# Altium project Cells_in_Space.PrjPcb (part 1 of 2)
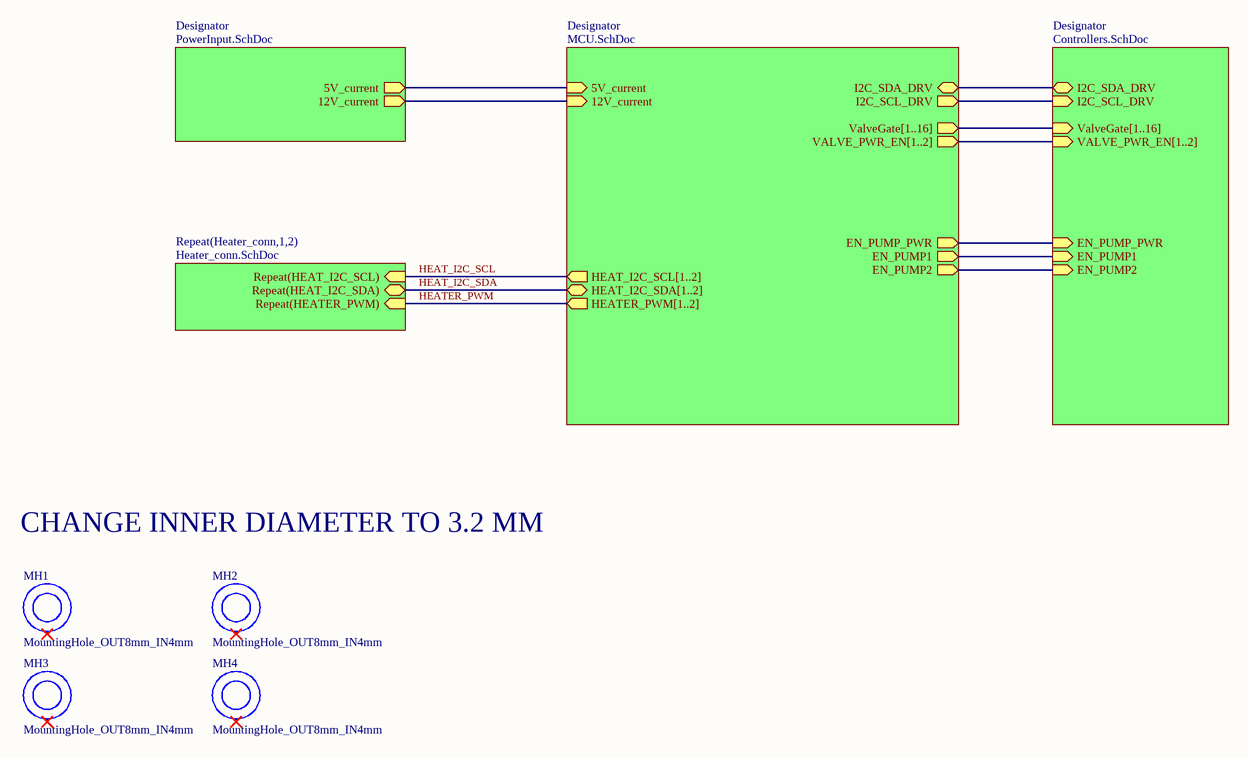
[diagram p0: GraviTE_TOP.SchDoc]
7 sheets, 230 parts. Net scope: hierarchical (ports join the sheet entries above them; power ports are global).
Board file: ISS_PCB.PcbDoc
Sheets:
  GraviTE_TOP.SchDoc
    Designator = PowerInput.SchDoc
    Designator = MCU.SchDoc
    Designator = Controllers.SchDoc
      CC_oct_driver1 = CC_oct_driver.SchDoc
      CC_oct_driver2 = CC_oct_driver.SchDoc
      Valve1 = Valve.SchDoc
      Valve2 = Valve.SchDoc
      Valve3 = Valve.SchDoc
      Valve4 = Valve.SchDoc
      Valve5 = Valve.SchDoc
      Valve6 = Valve.SchDoc
      Valve7 = Valve.SchDoc
      Valve8 = Valve.SchDoc
      Valve9 = Valve.SchDoc
      Valve10 = Valve.SchDoc
      Valve11 = Valve.SchDoc
      Valve12 = Valve.SchDoc
      Valve13 = Valve.SchDoc
      Valve14 = Valve.SchDoc
      Valve15 = Valve.SchDoc
      Valve16 = Valve.SchDoc
    Heater_conn1 = Heater_conn.SchDoc
    Heater_conn2 = Heater_conn.SchDoc

## Sheet GraviTE_TOP.SchDoc
size A4; SheetNumber: 1; SheetTotal: 7

### Parts
MH1  MountingHole_OUT8mm_IN4mm  [MountingHole_OUT8mm_IN4mm]
MH2  MountingHole_OUT8mm_IN4mm  [MountingHole_OUT8mm_IN4mm]
MH3  MountingHole_OUT8mm_IN4mm  [MountingHole_OUT8mm_IN4mm]
MH4  MountingHole_OUT8mm_IN4mm  [MountingHole_OUT8mm_IN4mm]

### Sub-sheets
Designator = PowerInput.SchDoc: 5V_current (out), 12V_current (out)
Designator = MCU.SchDoc: EN_PUMP_PWR (out), EN_PUMP1 (out), EN_PUMP2 (out), 12V_current (in), 5V_current (in), HEAT_I2C_SCL[1..2] (out), HEAT_I2C_SDA[1..2] (bidir), HEATER_PWM[1..2] (out), ValveGate[1..16] (out), VALVE_PWR_EN[1..2] (out), I2C_SDA_DRV (bidir), I2C_SCL_DRV (out)
Designator = Controllers.SchDoc: EN_PUMP_PWR (in), EN_PUMP1 (in), EN_PUMP2 (in), ValveGate[1..16] (in), VALVE_PWR_EN[1..2] (in), I2C_SDA_DRV (bidir), I2C_SCL_DRV (in)
Repeat(Heater_conn,1,2) = Heater_conn.SchDoc: Repeat(HEAT_I2C_SCL) (in), Repeat(HEAT_I2C_SDA) (bidir), Repeat(HEATER_PWM) (in)

### Nets
5V_current: sheet Designator/5V_current, sheet Designator/5V_current
12V_current: sheet Designator/12V_current, sheet Designator/12V_current
EN_PUMP1: sheet Designator/EN_PUMP1, sheet Designator/EN_PUMP1
EN_PUMP2: sheet Designator/EN_PUMP2, sheet Designator/EN_PUMP2
EN_PUMP_PWR: sheet Designator/EN_PUMP_PWR, sheet Designator/EN_PUMP_PWR
HEAT_I2C_SCL: sheet Repeat(Heater_conn,1,2)/Repeat(HEAT_I2C_SCL)
HEAT_I2C_SDA: sheet Repeat(Heater_conn,1,2)/Repeat(HEAT_I2C_SDA)
HEATER_PWM: sheet Repeat(Heater_conn,1,2)/Repeat(HEATER_PWM)
SCL: sheet Designator/I2C_SCL_DRV, sheet Designator/I2C_SCL_DRV
SDA: sheet Designator/I2C_SDA_DRV, sheet Designator/I2C_SDA_DRV

Not connected (* = marked no-connect by the designer): MH1 1*; MH2 1*; MH3 1*; MH4 1*

### Notes on the sheet
- CHANGE INNER DIAMETER TO 3.2 MM

## Sheet PowerInput.SchDoc
size A4; SheetNumber: 2; SheetTotal: 7
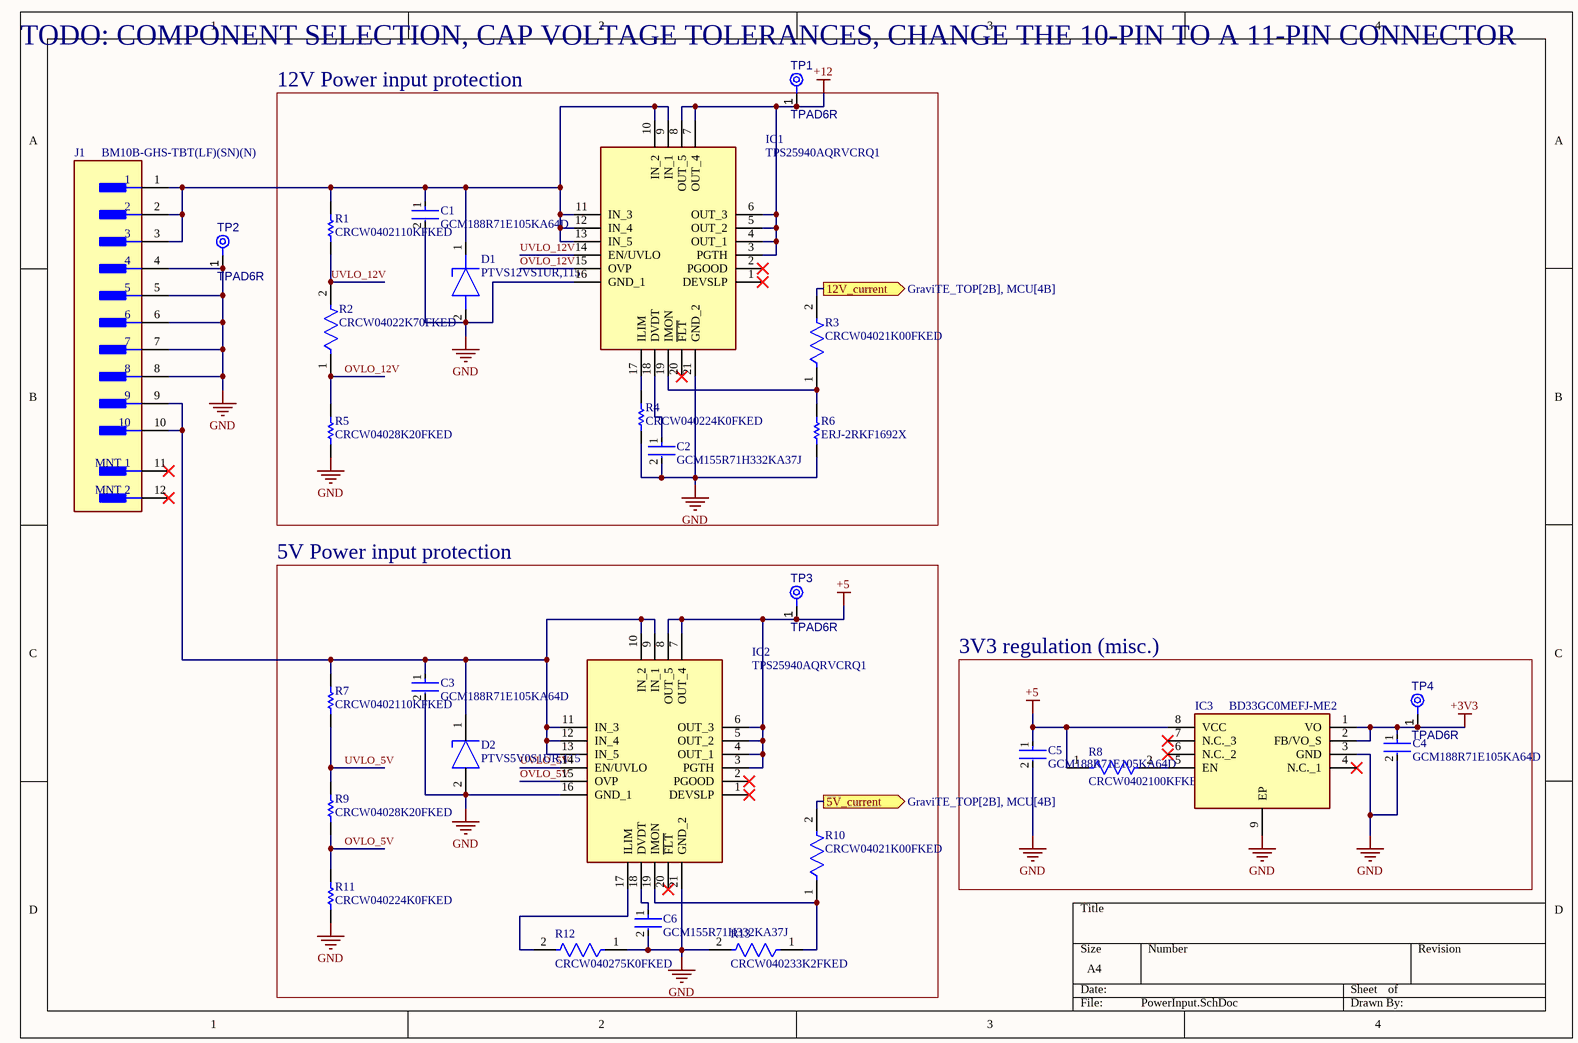
[diagram p1: PowerInput.SchDoc]

### Parts
C1  GCM188R71E105KA64D  [FP-GCM188-0_1-MFG]
C2  GCM155R71H332KA37J  [FP-GCM155-0_05-MFG]
C3  GCM188R71E105KA64D  [FP-GCM188-0_1-MFG]
C4  GCM188R71E105KA64D  [FP-GCM188-0_1-MFG]
C5  GCM188R71E105KA64D  [FP-GCM188-0_1-MFG]
C6  GCM155R71H332KA37J  [FP-GCM155-0_05-MFG]
D1  PTVS12VS1UR,115  [SOD123W]
D2  PTVS5V0S1UR,115  [FP-SOD123W-MFG]
IC1  TPS25940AQRVCRQ1  [QFN50P300X400X80-21N]
IC2  TPS25940AQRVCRQ1  [QFN50P300X400X80-21N]
IC3  BD33GC0MEFJ-ME2  [SOIC127P600X100-9N]
J1  BM10B-GHS-TBT(LF)(SN)(N)  [FP-BM10B-GHS-TBT_LF_SN-MFG]
R1  CRCW0402110KFKED  [RESC1005X40X25NL05T05]
R2  CRCW04022K70FKED  [FP-CRCW0402-e3-IPC_A]
R3  CRCW04021K00FKED  [FP-CRCW0402-e3-MFG]
R4  CRCW040224K0FKED  [RESC1005X40X25ML05T05]
R5  CRCW04028K20FKED  [RESC1005X40X25ML05T05]
R6  ERJ-2RKF1692X  [RESC1005X40X25ML05T05]
R7  CRCW0402110KFKED  [RESC1005X40X25NL05T05]
R8  CRCW0402100KFKED  [FP-CRCW0402-e3-IPC_C]
R9  CRCW04028K20FKED  [RESC1005X40X25ML05T05]
R10  CRCW04021K00FKED  [FP-CRCW0402-e3-MFG]
R11  CRCW040224K0FKED  [RESC1005X40X25ML05T05]
R12  CRCW040275K0FKED  [FP-CRCW0402-e3-IPC_A]
R13  CRCW040233K2FKED  [Vishay_CRCW0402-e3_MFG]
TP1  TPAD6R  [TP06R]  (no BOM)
TP2  TPAD6R  [TP06R]  (no BOM)
TP3  TPAD6R  [TP06R]  (no BOM)
TP4  TPAD6R  [TP06R]  (no BOM)

### Blocks framed on the sheet
12V Power input protection: C1 C2 D1 IC1 R1-R6
5V Power input protection: C3 C6 D2 IC2 R7 R9-R13 TP3
3V3 regulation (misc.): C4 C5 IC3 R8 TP4

### Ports
5V_current (out, see GraviTE_TOP[2B], MCU[4B]), 12V_current (out, see GraviTE_TOP[2B], MCU[4B])

### Nets
+3V3: C4.1 IC3.1(VO) IC3.2(FB/VO_S) TP4.1(TP)
+5: C5.1 IC2.3(PGTH) IC2.4(OUT_1) IC2.5(OUT_2) IC2.6(OUT_3) IC2.7(OUT_4) IC2.8(OUT_5) IC3.8(VCC) R8.1 TP3.1(TP)
+12: IC1.3(PGTH) IC1.4(OUT_1) IC1.5(OUT_2) IC1.6(OUT_3) IC1.7(OUT_4) IC1.8(OUT_5) TP1.1(TP)
GND: C1.2 C2.2 C3.2 C4.2 C5.2 C6.2 D1.2(A) D2.2(A) IC1.16(GND_1) IC1.21(GND_2) IC2.16(GND_1) IC2.21(GND_2) IC3.3(GND) IC3.9(EP) J1.4 J1.5 J1.6 J1.7 J1.8 R4.1 R5.1 R6.1 R11.1 R12.1 R13.2 TP2.1(TP)
5V_current: R10.2 ; port 5V_current
12V_current: R3.2 ; port 12V_current
OVLO_5V: IC2.15(OVP) R9.1 R11.2
OVLO_12V: IC1.15(OVP) R2.1 R5.2
UVLO_5V: IC2.14(EN/UVLO) R7.1 R9.2
UVLO_12V: IC1.14(EN/UVLO) R1.1 R2.2
NetC1_1: C1.1 D1.1(K) IC1.9(IN_1) IC1.10(IN_2) IC1.11(IN_3) IC1.12(IN_4) IC1.13(IN_5) J1.1 J1.2 J1.3 R1.2
NetC2_1: C2.1 IC1.18(DVDT)
NetC3_1: C3.1 D2.1(C) IC2.9(IN_1) IC2.10(IN_2) IC2.11(IN_3) IC2.12(IN_4) IC2.13(IN_5) J1.9 J1.10 R7.2
NetC6_1: C6.1 IC2.18(DVDT)
NetIC1_17: IC1.17(ILIM) R4.2
NetIC1_19: IC1.19(IMON) R3.1 R6.2
NetIC2_17: IC2.17(ILIM) R12.2
NetIC2_19: IC2.19(IMON) R10.1 R13.1
NetIC3_5: IC3.5(EN) R8.2

Not connected (* = marked no-connect by the designer): IC1 1(DEVSLP)* 2(PGOOD)* 20(~{FLT})*; IC2 1(DEVSLP)* 2(PGOOD)* 20(~{FLT})*; IC3 4(N.C._1)* 6(N.C._2)* 7(N.C._3)*; J1 11(MNT_1)* 12(MNT_2)*

### Notes on the sheet
- (near TP1) TODO: COMPONENT SELECTION, CAP VOLTAGE TOLERANCES, CHANGE THE 10-PIN TO A 11-PIN CONNECTOR

### Library data of the parts
C1 C3-C5 = CMP-2006-02363-4: Manufacturer Lifecycle Status: IN PRODUCTION; NexarPartId: 18909256; Dielectric: X7R; Material: Ceramic; Tolerance: 10%; Capacitance: 1µF; Voltage Rating: 25V; Thickness: 889µm; Max Operating Temperature: 125°C; Radiation Hardening: No; Weight: 6.293594mg; Lead Free: Lead Free; Mount: Surface Mount; Case Code (Imperial): 0603; REACH SVHC: No SVHC; Lifecycle Status: Production; Depth: 800µm; Min Operating Temperature: -55°C; Height: 800µm; Case Code (Metric): 1608; Case/Package: 0603; Voltage: 25V; Packaging: Cut Tape; Length: 1.6mm; Termination: SMD/SMT; Width: 787.4µm; Voltage Rating (DC): 25V; RoHS: Compliant; Schedule B: 8532240020, 8532240020; Ratings: AEC-Q200
C2 C6 = CMP-06035-006656-1: Ceramic Capacitor for Automotive 3.3nF ±10% 50VDC X7R 0402 Paper T/R; Voltage Rating (DC): 50V; Max Operating Temperature: 125°C; Termination: SMD/SMT; Depth: 0.5mm; Min Operating Temperature: -55°C; Voltage Rating: 50V; Length: 1mm; Radiation Hardening: No; Tolerance: 10%; Case Code (Imperial): 0402; Mount: Surface Mount; Package Quantity: 50000; Width: 0.5mm; Height: 0.5mm; Case Code (Metric): 1005; Capacitance: 3.3nF; Packaging: Tape and Reel; Case/Package: 0402; Dielectric: X7R
D1 = PTVS12VS1UR,115: Diode ESD (Uni-directional); Manufacturer_Name: Nexperia; Datasheet Link: https://assets.nexperia.com/documents/data-sheet/PTVSXS1UR_SER.pdf; Manufacturer_Part_Number: PTVS12VS1UR,115; Mouser Part Number: 771-PTVS12VS1UR115; Mouser Price/Stock: https://www.mouser.co.uk/ProductDetail/Nexperia/PTVS12VS1UR115?qs=LMSg3oBIm%2FiWSHvsyxWiLg%3D%3D; Arrow Part Number: PTVS12VS1UR,115; Arrow Price/Stock: https://www.arrow.com/en/products/ptvs12vs1ur115/nexperia?region=nac
D2 = CMP-14436-000018-1: TVS DIODE 5VWM 9.2VC CFP3; RoHS Compliant: Yes
IC1 IC2 = TPS25940AQRVCRQ1: Integrated Circuit; Manufacturer_Name: Texas Instruments; Datasheet Link: http://www.ti.com/lit/gpn/tps25940-q1; Height: 0.8mm; Manufacturer_Part_Number: TPS25940AQRVCRQ1; Mouser Part Number: 595-TPS25940AQRVCRQ1; Mouser Price/Stock: https://www.mouser.co.uk/ProductDetail/Texas-Instruments/TPS25940AQRVCRQ1?qs=osPbIpHqQ9Uam0Tf4VM8lQ%3D%3D; Arrow Part Number: TPS25940AQRVCRQ1; Arrow Price/Stock: https://www.arrow.com/en/products/tps25940aqrvcrq1/texas-instruments
IC3 = BD33GC0MEFJ-ME2: Integrated Circuit; Manufacturer_Name: ROHM Semiconductor; Datasheet Link: https://www.mouser.cl/datasheet/2/348/bdxxgc0mefj-m-e-1874062.pdf; Height: 1mm; Manufacturer_Part_Number: BD33GC0MEFJ-ME2; Mouser Part Number: 755-BD33GC0MEFJ-ME2; Mouser Price/Stock: https://www.mouser.com/Search/Refine.aspx?Keyword=755-BD33GC0MEFJ-ME2
J1 = CMP-17439-000269-1: CONN HEADER SMD 10POS 1.25MM; Mated Stacking Heights: 7.3mm; Number of Positions: 10; Voltage Rating: 50V; Packaging: Cut Tape; Contact Shape: Rectangular; Insulation Material: Nylon; Contact Type: Outer Shroud Contact; Contact Finish - Mating: TIN; Fastening Type: Ramp; Termination: Solder; Max Operating Temperature: 85°C; Min Operating Temperature: -25°C; Insulation Color: Natural; Number of Rows: 1; Flammability Rating: UL94 V-0; Contact Material: Bronze; Mount: Surface Mount; Series: GH; Connector Type: Header
R1 R7 = CMP-2002-08148-1: Manufacturer: Vishay Dale; Part Number: CRCW0402110KFKED
R2 = CMP-2002-08466-2: RES Thick Film, 2.7kΩ, 1%, 0.063W, 100ppm/°C, 0402; Power Rating: 63mW; Voltage Rating (DC): 50V; Resistance: 2.7kR; Termination: SMD/SMT; Composition: Thick Film; Packaging: Tape and Reel; Tolerance: 1%; Number of Pins: 2; Contact Plating: Tin; Max Operating Temperature: 155°C; Depth: 0.5mm; Features: Automotive AEC-Q200; Lead Free: Lead Free; Number of Terminations: 2; Case/Package: 0402; Max Power Dissipation: 63mW; Radiation Hardening: No; Height: 0.35mm; Min Operating Temperature: -55°C; Width: 0.02inch; Military Standard: Not; Package Quantity: 10; Weight: 2.3E-05oz; Temperature Coefficient: 100ppm/°C; Case Code (Metric): 1005; Voltage Rating: 50V; Length: 1mm; Case Code (Imperial): 0402
R3 R10 = CMP-2002-08276-2: RES Thick Film, 1kΩ, 1%, 0.063W, 100ppm/°C, 0402; Resistance: 1kR; Power Rating: 63mW; Voltage Rating (DC): 50V; Package Quantity: 10; Termination: SMD/SMT; Width: 0.5mm; Military Standard: Not; Length: 1mm; Contact Plating: Tin; Mount: Surface Mount; Packaging: Tape and Reel; Case Code (Imperial): 0402; Tolerance: 1%; Weight: 2.3E-05oz; Number of Pins: 2; Case/Package: 0402; Case Code (Metric): 1005; Lead Free: Lead Free; Number of Terminations: 2; Max Power Dissipation: 63mW; Depth: 0.5mm; Temperature Coefficient: 100ppm/°C; Max Operating Temperature: 155°C; Height: 0.35mm; Features: Automotive AEC-Q200; Composition: Thick Film; Radiation Hardening: No; Voltage Rating: 50V; Min Operating Temperature: -55°C
R4 R11 = CMP-2002-08403-1: Manufacturer: Vishay Dale; Part Number: CRCW040224K0FKED
R5 R9 = CMP-2002-00254-1: Manufacturer: Vishay Dale; Part Number: CRCW04028K20FKED
R6 = CMP-1011-00647-2: Manufacturer: Panasonic; Part Number: ERJ-2RKF1692X
R8 = CMP-2002-08123-3: RES Thick Film, 100kΩ, 1%, 0.063W, 100ppm/°C, 0402; Power Rating: 63mW; Resistance: 100kR; Voltage Rating (DC): 50V; Lead Free: Lead Free; Height: 0.35mm; Contact Plating: Tin; Min Operating Temperature: -55°C; Package Quantity: 10000; Case/Package: 0402; Temperature Coefficient: 100ppm/°C; Number of Terminations: 2; Packaging: Tape and Reel; Max Power Dissipation: 63mW; Case Code (Metric): 1005; Mount: Surface Mount; Width: 0.02inch; Termination: SMD/SMT; Length: 1mm; Number of Pins: 2; Weight: 2.3E-05oz; Radiation Hardening: No; Tolerance: 1%; Military Standard: Not; Features: Automotive AEC-Q200; Depth: 0.5mm; Composition: Thick Film; Max Operating Temperature: 155°C; Voltage Rating: 50V; Case Code (Imperial): 0402
R12 = CMP-2002-00208-2: RES Thick Film, 75kΩ, 1%, 0.063W, 100ppm/°C, 0402; Voltage Rating (DC): 50V; Max Power Dissipation: 63mW; Resistance: 75kR; Packaging: Tape and Reel; Radiation Hardening: No; Features: Automotive AEC-Q200; Depth: 0.5mm; Number of Pins: 2; Case/Package: 0402; Weight: 2.3E-05oz; Width: 0.02inch; Height: 0.35mm; Termination: SMD/SMT; Lead Free: Lead Free; Voltage Rating: 50V; Min Operating Temperature: -55°C; Package Quantity: 10; Case Code (Imperial): 0402; Composition: Thick Film; Contact Plating: Tin; Mount: Surface Mount; Tolerance: 1%; Case Code (Metric): 1005; Max Operating Temperature: 155°C; Temperature Coefficient: 100ppm/°C; Number of Terminations: 2; Military Standard: Not; Length: 1mm; Power Rating: 63mW
R13 = CMP-2002-08529-2: NexarPartId: 39869749; Power Rating: 63mW; Temperature Coefficient: 100ppm/°C; Resistance: 33.2kΩ; Voltage Rating: 50V; Tolerance: 1%; REACH SVHC: Unknown; Number of Pins: 2; Military Standard: Not; Composition: Thick Film; Case Code (Imperial): 0402; Number of Terminations: 2; Lead Free: Lead Free; Case Code (Metric): 1005; Termination: SMD/SMT; Case/Package: 0402; Contact Plating: Tin; Height: 350µm; Min Operating Temperature: -55°C; Mount: Surface Mount; Max Operating Temperature: 155°C; Features: Automotive AEC-Q200; Length: 1mm; Weight: 652.039032µg; Packaging: Cut Tape; Schedule B: 8533210045, 8533210045; Voltage Rating (DC): 50V; Depth: 500µm; Max Power Dissipation: 63mW; RoHS: Compliant; Radiation Hardening: No; Width: 500µm
TP1-TP4 = CMP-00028-00002-2: 0.6mm round; Pins: 1

## Sheet MCU.SchDoc
size A3; SheetNumber: 3; SheetTotal: 7
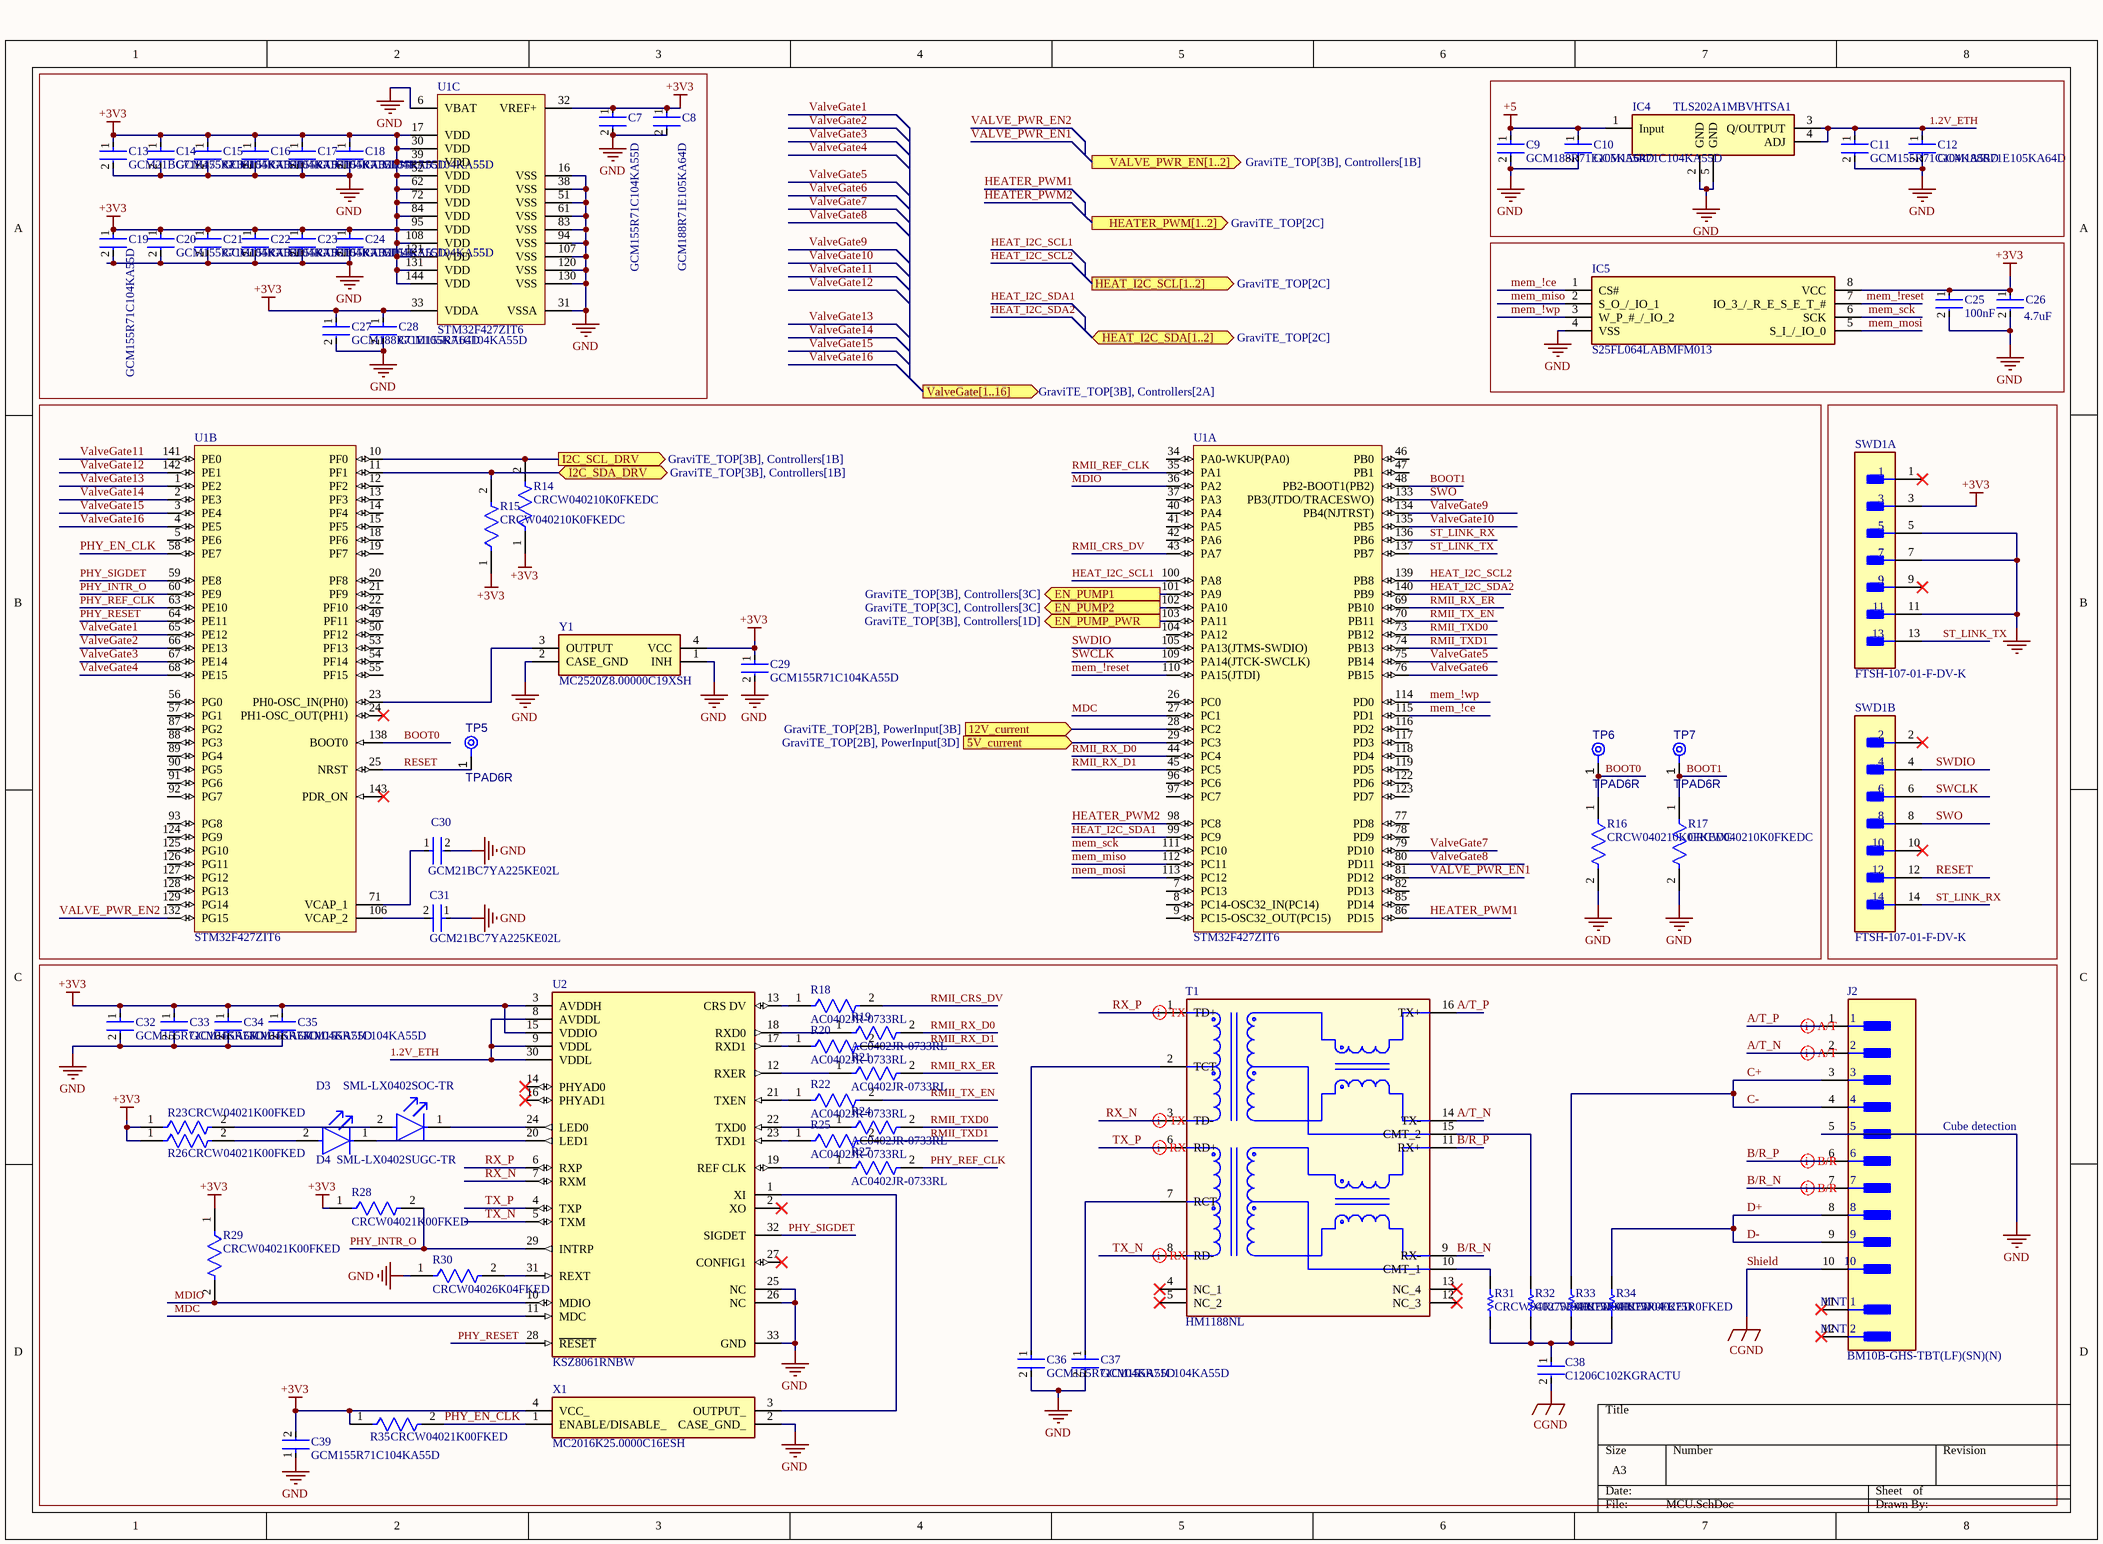
[diagram p2: MCU.SchDoc]

### Parts
C7  GCM155R71C104KA55D  [FP-GCM155-0_05-IPC_C]
C8  GCM188R71E105KA64D  [FP-GCM188-0_1-MFG]
C9  GCM188R71E105KA64D  [FP-GCM188-0_1-MFG]
C10  GCM155R71C104KA55D  [FP-GCM155-0_05-IPC_C]
C11  GCM155R71C104KA55D  [FP-GCM155-0_05-IPC_C]
C12  GCM188R71E105KA64D  [FP-GCM188-0_1-MFG]
C13  GCM21BC71E475KE36L  [FP-GCM21B-0_2-e0_2_0_7-IPC_C]
C14  GCM155R71C104KA55D  [FP-GCM155-0_05-IPC_C]
C15  GCM155R71C104KA55D  [FP-GCM155-0_05-IPC_C]
C16  GCM155R71C104KA55D  [FP-GCM155-0_05-IPC_C]
C17  GCM155R71C104KA55D  [FP-GCM155-0_05-IPC_C]
C18  GCM155R71C104KA55D  [FP-GCM155-0_05-IPC_C]
C19  GCM155R71C104KA55D  [FP-GCM155-0_05-IPC_C]
C20  GCM155R71C104KA55D  [FP-GCM155-0_05-IPC_C]
C21  GCM155R71C104KA55D  [FP-GCM155-0_05-IPC_C]
C22  GCM155R71C104KA55D  [FP-GCM155-0_05-IPC_C]
C23  GCM155R71C104KA55D  [FP-GCM155-0_05-IPC_C]
C24  GCM155R71C104KA55D  [FP-GCM155-0_05-IPC_C]
C25  100nF  [FP-GCM155-0_05-IPC_C]
C26  4.7uF  [FP-GCM21B-0_2-e0_2_0_7-IPC_C]
C27  GCM188R71E105KA64D  [FP-GCM188-0_1-MFG]
C28  GCM155R71C104KA55D  [FP-GCM155-0_05-IPC_C]
C29  GCM155R71C104KA55D  [FP-GCM155-0_05-IPC_C]
C30  GCM21BC7YA225KE02L  [FP-GCM21B-0_15-MFG]
C31  GCM21BC7YA225KE02L  [FP-GCM21B-0_15-MFG]
C32  GCM155R71C104KA55D  [FP-GCM155-0_05-IPC_C]
C33  GCM155R71C104KA55D  [FP-GCM155-0_05-IPC_C]
C34  GCM155R71C104KA55D  [FP-GCM155-0_05-IPC_C]
C35  GCM155R71C104KA55D  [FP-GCM155-0_05-IPC_C]
C36  GCM155R71C104KA55D  [FP-GCM155-0_05-IPC_C]
C37  GCM155R71C104KA55D  [FP-GCM155-0_05-IPC_C]
C38  C1206C102KGRACTU  [FP-C1206C-EF-MFG]
C39  GCM155R71C104KA55D  [FP-GCM155-0_05-IPC_C]
D3  SML-LX0402SOC-TR  [FP-SML-LX0402SOC-TR-MFG]
D4  SML-LX0402SUGC-TR  [FP-SML-LX0402SUGC-TR-MFG]
IC4  TLS202A1MBVHTSA1  [TLS202A1MBVHTSA1]
IC5  S25FL064LABMFM013  [SOIC127P800X216-8N]
J2  BM10B-GHS-TBT(LF)(SN)(N)  [FP-BM10B-GHS-TBT_LF_SN-MFG]
R14  CRCW040210K0FKEDC  [FP-CRCW0402-C-e3-IPC_C]
R15  CRCW040210K0FKEDC  [FP-CRCW0402-C-e3-IPC_C]
R16  CRCW040210K0FKEDC  [FP-CRCW0402-C-e3-IPC_C]
R17  CRCW040210K0FKEDC  [FP-CRCW0402-C-e3-IPC_C]
R18  AC0402JR-0733RL  [FP-AC0402-IPC_B]
R19  AC0402JR-0733RL  [FP-AC0402-IPC_B]
R20  AC0402JR-0733RL  [FP-AC0402-IPC_B]
R21  AC0402JR-0733RL  [FP-AC0402-IPC_B]
R22  AC0402JR-0733RL  [FP-AC0402-IPC_B]
R23  CRCW04021K00FKED  [FP-CRCW0402-e3-MFG]
R24  AC0402JR-0733RL  [FP-AC0402-IPC_B]
R25  AC0402JR-0733RL  [FP-AC0402-IPC_B]
R26  CRCW04021K00FKED  [FP-CRCW0402-e3-MFG]
R27  AC0402JR-0733RL  [FP-AC0402-IPC_B]
R28  CRCW04021K00FKED  [FP-CRCW0402-e3-MFG]
R29  CRCW04021K00FKED  [FP-CRCW0402-e3-MFG]
R30  CRCW04026K04FKED  [FP-CRCW0402-e3-IPC_A]
R31  CRCW040275R0FKED  [RESC1005X40X25NL05T05]
R32  CRCW040275R0FKED  [RESC1005X40X25NL05T05]
R33  CRCW040275R0FKED  [RESC1005X40X25NL05T05]
R34  CRCW040275R0FKED  [RESC1005X40X25NL05T05]
R35  CRCW04021K00FKED  [FP-CRCW0402-e3-MFG]
SWD1  FTSH-107-01-F-DV-K  [FP-FTSH-107-01-F-DV-K-MFG]  (parts A,B of 2)
T1  HM1188NL  [HM1188NL]
TP5  TPAD6R  [TP06R]  (no BOM)
TP6  TPAD6R  [TP06R]  (no BOM)
TP7  TPAD6R  [TP06R]  (no BOM)
U1  STM32F427ZIT6  [STM-LQFP144_V]  (parts A,B,C of 3)
U2  KSZ8061RNBW  [FP-QFN55-32LD-PL-5-IPC_A]
X1  MC2016K25.0000C16ESH  [MC2016K250000C16ESH]
Y1  MC2520Z8.00000C19XSH  [MC2520Z800000C19XSH]

### Blocks framed on the sheet
Cube detection: C32-C39 D3 D4 J2 R18-R35 T1 U2 X1

### Ports
5V_current (in, see GraviTE_TOP[2B], PowerInput[3D]), 12V_current (in, see GraviTE_TOP[2B], PowerInput[3B]), EN_PUMP1 (out, see GraviTE_TOP[3B], Controllers[3C]), EN_PUMP2 (out, see GraviTE_TOP[3C], Controllers[3C]), EN_PUMP_PWR (out, see GraviTE_TOP[3B], Controllers[1D]), HEAT_I2C_SCL[1..2] (out, see GraviTE_TOP[2C]), HEAT_I2C_SDA[1..2] (bidir, see GraviTE_TOP[2C]), HEATER_PWM[1..2] (out, see GraviTE_TOP[2C]), I2C_SCL_DRV (out, see GraviTE_TOP[3B], Controllers[1B]), I2C_SDA_DRV (bidir, see GraviTE_TOP[3B], Controllers[1B]), VALVE_PWR_EN[1..2] (out, see GraviTE_TOP[3B], Controllers[1B]), ValveGate[1..16] (out, see GraviTE_TOP[3B], Controllers[2A])

### Nets
+3V3: C7.1 C8.1 C13.1 C14.1 C15.1 C16.1 C17.1 C18.1 C19.1 C20.1 C21.1 C22.1 C23.1 C24.1 C25.1 C26.1 C27.1 C28.1 C29.1 C32.1 C33.1 C34.1 C35.1 C39.2 IC5.8(VCC) R14.1 R15.1 R23.1 R26.1 R28.1 R29.1 R35.1 SWD1.3 U1.17(VDD) U1.30(VDD) U1.32(VREF+) U1.33(VDDA) U1.39(VDD) U1.52(VDD) U1.62(VDD) U1.72(VDD) U1.84(VDD) U1.95(VDD) U1.108(VDD) U1.121(VDD) U1.131(VDD) U1.144(VDD) U2.3(AVDDH) U2.15(VDDIO) X1.4(VCC_) Y1.4(VCC)
+5: C9.1 C10.1 IC4.1(Input)
CGND: C38.2 J2.10  [also labelled Shield]
GND: C7.2 C8.2 C9.2 C10.2 C11.2 C12.2 C13.2 C14.2 C15.2 C16.2 C17.2 C18.2 C19.2 C20.2 C21.2 C22.2 C23.2 C24.2 C25.2 C26.2 C27.2 C28.2 C29.2 C30.2 C31.1 C32.2 C33.2 C34.2 C35.2 C36.2 C37.2 C39.1 IC4.2(GND) IC4.5(GND) IC5.4(VSS) J2.5 R16.2 R17.2 R30.1 SWD1.5 SWD1.7 SWD1.11 U1.6(VBAT) U1.16(VSS) U1.31(VSSA) U1.38(VSS) U1.51(VSS) U1.61(VSS) U1.83(VSS) U1.94(VSS) U1.107(VSS) U1.120(VSS) U1.130(VSS) U2.25(NC) U2.26(NC) U2.33(GND) X1.2(CASE_GND_) Y1.1(INH) Y1.2(CASE_GND)
1.2V_ETH: C11.1 C12.1 IC4.3(Q/OUTPUT) IC4.4(ADJ) U2.8(AVDDL) U2.9(VDDL) U2.30(VDDL)
5V_current: U1.29(PC3) ; port 5V_current
12V_current: U1.28(PC2) ; port 12V_current
A/T_N: J2.2 T1.14(TX-)
A/T_P: J2.1 T1.16(TX+)
B/R_N: J2.7 T1.9(RX-)
B/R_P: J2.6 T1.11(RX+)
BOOT0: R16.1 TP6.1(TP) U1.138(BOOT0)
BOOT1: R17.1 TP7.1(TP) U1.48(PB2-BOOT1(PB2))
C+: J2.3 J2.4 R33.2  [also labelled C-]
D+: J2.8 J2.9 R34.2  [also labelled D-]
EN_PUMP1: U1.101(PA9) ; port EN_PUMP1
EN_PUMP2: U1.102(PA10) ; port EN_PUMP2
EN_PUMP_PWR: U1.103(PA11) ; port EN_PUMP_PWR
HEAT_I2C_SCL1: U1.100(PA8)
HEAT_I2C_SCL2: U1.139(PB8)
HEAT_I2C_SDA1: U1.99(PC9)
HEAT_I2C_SDA2: U1.140(PB9)
HEATER_PWM1: U1.86(PD15)
HEATER_PWM2: U1.98(PC8)
MDC: U1.27(PC1) U2.11(MDC)
MDIO: R29.2 U1.36(PA2) U2.10(MDIO)
mem_!ce: IC5.1(CS#) U1.115(PD1)
mem_!reset: IC5.7(IO_3_/_R_E_S_E_T_#) U1.110(PA15(JTDI))
mem_!wp: IC5.3(W_P_#_/_IO_2) U1.114(PD0)
mem_miso: IC5.2(S_O_/_IO_1) U1.112(PC11)
mem_mosi: IC5.5(S_I_/_IO_0) U1.113(PC12)
mem_sck: IC5.6(SCK) U1.111(PC10)
PHY_EN_CLK: R35.2 U1.58(PE7) X1.1(ENABLE/DISABLE_)
PHY_INTR_O: R28.2 U1.60(PE9) U2.29(INTRP)
PHY_REF_CLK: R27.2 U1.63(PE10)
PHY_RESET: U1.64(PE11) U2.28(~{RESET})
PHY_SIGDET: U1.59(PE8) U2.32(SIGDET)
RESET: SWD1.12 TP5.1(TP) U1.25(NRST)
RMII_CRS_DV: R18.2 U1.43(PA7)
RMII_REF_CLK: U1.35(PA1)
RMII_RX_D0: R19.2 U1.44(PC4)
RMII_RX_D1: R20.2 U1.45(PC5)
RMII_RX_ER: R21.2 U1.69(PB10)
RMII_TX_EN: R22.2 U1.70(PB11)
RMII_TXD0: R24.2 U1.73(PB12)
RMII_TXD1: R25.2 U1.74(PB13)
RX_N: T1.3(TD-) U2.7(RXM)
RX_P: T1.1(TD+) U2.6(RXP)
SCL: R14.2 U1.10(PF0) ; port I2C_SCL_DRV
SDA: R15.2 U1.11(PF1) ; port I2C_SDA_DRV
ST_LINK_RX: SWD1.14 U1.136(PB6)
ST_LINK_TX: SWD1.13 U1.137(PB7)
SWCLK: SWD1.6 U1.109(PA14(JTCK-SWCLK))
SWDIO: SWD1.4 U1.105(PA13(JTMS-SWDIO))
SWO: SWD1.8 U1.133(PB3(JTDO/TRACESWO))
TX_N: T1.8(RD-) U2.5(TXM)
TX_P: T1.6(RD+) U2.4(TXP)
VALVE_PWR_EN1: U1.81(PD12)
VALVE_PWR_EN2: U1.132(PG15)
ValveGate1: U1.65(PE12)
ValveGate2: U1.66(PE13)
ValveGate3: U1.67(PE14)
ValveGate4: U1.68(PE15)
ValveGate5: U1.75(PB14)
ValveGate6: U1.76(PB15)
ValveGate7: U1.79(PD10)
ValveGate8: U1.80(PD11)
ValveGate9: U1.134(PB4(NJTRST))
ValveGate10: U1.135(PB5)
ValveGate11: U1.141(PE0)
ValveGate12: U1.142(PE1)
ValveGate13: U1.1(PE2)
ValveGate14: U1.2(PE3)
ValveGate15: U1.3(PE4)
ValveGate16: U1.4(PE5)
NetC30_1: C30.1 U1.71(VCAP_1)
NetC31_2: C31.2 U1.106(VCAP_2)
NetC36_1: C36.1 T1.2(TCT)
NetC37_1: C37.1 T1.7(RCT)
NetC38_1: C38.1 R31.1 R32.1 R33.1 R34.1
NetD3_1: D3.1(C) U2.24(LED0)
NetD3_2: D3.2(A) R23.2
NetD4_1: D4.1(C) U2.20(LED1)
NetD4_2: D4.2(A) R26.2
NetR18_1: R18.1 U2.13(CRS_DV)
NetR19_1: R19.1 U2.18(RXD0)
NetR20_1: R20.1 U2.17(RXD1)
NetR21_1: R21.1 U2.12(RXER)
NetR22_1: R22.1 U2.21(TXEN)
NetR24_1: R24.1 U2.22(TXD0)
NetR25_1: R25.1 U2.23(TXD1)
NetR27_1: R27.1 U2.19(REF_CLK)
NetR30_2: R30.2 U2.31(REXT)
NetR31_2: R31.2 T1.10(CMT_1)
NetR32_2: R32.2 T1.15(CMT_2)
NetU1_23: U1.23(PH0-OSC_IN(PH0)) Y1.3(OUTPUT)
NetU2_1: U2.1(XI) X1.3(OUTPUT_)

Not connected (* = marked no-connect by the designer): J2 11(MNT_1)* 12(MNT_2)*; SWD1 1* 2* 9* 10*; T1 4(NC_1)* 5(NC_2)* 12(NC_3)* 13(NC_4)*; U1 5(PE6) 7(PC13) 8(PC14-OSC32_IN(PC14)) 9(PC15-OSC32_OUT(PC15)) 12(PF2) 13(PF3) 14(PF4) 15(PF5) 18(PF6) 19(PF7) 20(PF8) 21(PF9) 22(PF10) 24(PH1-OSC_OUT(PH1))* 26(PC0) 34(PA0-WKUP(PA0)) 37(PA3) 40(PA4) 41(PA5) 42(PA6) 46(PB0) 47(PB1) 49(PF11) 50(PF12) 53(PF13) 54(PF14) 55(PF15) 56(PG0) 57(PG1) 77(PD8) 78(PD9) 82(PD13) 85(PD14) 87(PG2) 88(PG3) 89(PG4) 90(PG5) 91(PG6) 92(PG7) 93(PG8) 96(PC6) 97(PC7) 104(PA12) 116(PD2) 117(PD3) 118(PD4) 119(PD5) 122(PD6) 123(PD7) 124(PG9) 125(PG10) 126(PG11) 127(PG12) 128(PG13) 129(PG14) 143(PDR_ON)*; U2 2(XO)* 14(PHYAD0)* 16(PHYAD1)* 27(CONFIG1)*

### Layout directives
differential pair: A/T_N, A/T_P, B/R_N, B/R_P, RX_N, RX_P, TX_N, TX_P

### Library data of the parts
C7 C10 C11 C14-C25 C28 C29 C32-C37 C39 = CMP-2008-03711-3: Ceramic Capacitor for Automotive 100nF ±10% 16VDC X7R 0402 Paper T/R; Voltage Rating (DC): 16V; Termination: SMD/SMT; Length: 1mm; Voltage: 16V; Mount: Surface Mount; Packaging: Tape and Reel; Case Code (Metric): 1005; Case/Package: 0402; Voltage Rating: 16V; Min Operating Temperature: -55°C; Case Code (Imperial): 0402; Ratings: AEC-Q200; Height: 0.5mm; Tolerance: 10%; Width: 0.02inch; Radiation Hardening: No; Depth: 0.5mm; Capacitance: 100nF; Max Operating Temperature: 125°C; Package Quantity: 1; REACH SVHC: No SVHC; Thickness: 0.022inch; Dielectric: X7R; Lead Free: Lead Free
C8 C9 C12 C27 = CMP-2006-02363-4: as C1 on sheet PowerInput; Thickness: 889µm; Max Operating Temperature: 125°C; Radiation Hardening: No; Weight: 6.293594mg; Lead Free: Lead Free; Mount: Surface Mount; Case Code (Imperial): 0603; REACH SVHC: No SVHC; Lifecycle Status: Production; Depth: 800µm; Min Operating Temperature: -55°C; Height: 800µm; Case Code (Metric): 1608; Case/Package: 0603; Voltage: 25V; Packaging: Cut Tape; Length: 1.6mm; Termination: SMD/SMT; Width: 787.4µm; Voltage Rating (DC): 25V; RoHS: Compliant; Schedule B: 8532240020, 8532240020; Ratings: AEC-Q200
C13 C26 = CMP-06035-049372-1: Ceramic Capacitor for Automotive 4.7uF ±10% 25VDC X7S 0805 Embossed T/R; Voltage Rating: 25V; Mount: Surface Mount; Case/Package: 0805; Case Code (Imperial): 0805; Tolerance: 10%; Max Operating Temperature: 125°C; Capacitance: 4.7uF; Packaging: Cut Tape; Min Operating Temperature: -55°C; Ratings: AEC-Q200; Case Code (Metric): 2012
C30 C31 = CMP-06035-026512-1: Ceramic Capacitor for Automotive 2.2uF ±10% 35VDC X7S 0805 Embossed T/R; Voltage Rating: 35V; Capacitance: 2.2uF; Case Code (Metric): 2012; Max Operating Temperature: 125°C; Min Operating Temperature: -55°C; Case Code (Imperial): 0805; Ratings: AEC-Q200; Packaging: Cut Tape; Mount: Surface Mount; Tolerance: 10%; Case/Package: 0805
C38 = CMP-03020-034681-1: CAP CER 1000PF 2KV X7R 1206; Tolerance: 10%; Capacitance: 1nF; Dissipation Factor: 2.5%; Dielectric Material: Ceramic; Voltage Rating (DC): 2.5kV; Voltage: 2kV; REACH SVHC: No SVHC; Height: 1.6mm; Construction: Flat; Case/Package: 1206; Series: C; Mount: Surface Mount; RoHS Compliant: Yes; Package Quantity: 1; Length: 3.2mm; Width: 0.063inch; Voltage Rating: 2kV; Min Operating Temperature: -55°C; Case Code (Metric): 3216; Termination: SMD/SMT; Number of Pins: 2; Case Code (Imperial): 1206; Packaging: Tape and Reel; Dielectric: X7R; Thickness: 0.069inch; Depth: 1.6mm; Radiation Hardening: No; Max Operating Temperature: 125°C
D3 = CMP-57192-000002-1: LED ORANGE CLEAR SMD; Forward Voltage: 2V; Viewing Angle: 120°; Luminous Intensity: 120mcd; Wavelength: 610nm; Forward Current: 20mA; Number of LEDs: 1; Lens Color: Colorless; Max Operating Temperature: 85°C; Mount: Surface Mount; Lens Transparency: Clear; Lens Style: Clear; Case Code (Metric): 1005; Length: 1mm; Package Quantity: 1; Case Code (Imperial): 0402; Color: Orange; Illumination Color: Orange; Width: 0.5mm; Packaging: Tape and Reel; Test Current: 20mA; Min Operating Temperature: -40°C; Height: 0.5mm; Number of Pins: 2; Lead Free: Lead Free; Case/Package: 0402
D4 = CMP-57192-000001-1: LED GREEN CLEAR SMD; Forward Voltage: 2.2V; Test Current: 20mA; Luminous Intensity: 45mcd; Lens Style: Diffused; Number of LEDs: 1; Approvals: UL; Lens Color: Colorless; Dominant Wavelength: 574nm; Viewing Angle: 120°; Lead Free: Lead Free; Case/Package: 0402; Number of Pins: 2; Width: 0.5mm; Min Operating Temperature: -40°C; Case Code (Imperial): 0402; Packaging: Tape and Reel; Color: Green; Max Operating Temperature: 85°C; Case Code (Metric): 1005; Mount: Surface Mount; Length: 1mm; Wavelength: 574nm; Height: 0.5mm; Illumination Color: Green; Lens Transparency: Clear; Package Quantity: 1; Forward Current: 20mA
IC4 = TLS202A1MBVHTSA1: Integrated Circuit; Manufacturer_Name: Infineon; Datasheet Link: https://www.infineon.com/dgdl/Infineon-TLS202A1MBV-DS-v01_00-EN.pdf?fileId=5546d46258fc0bc1015969d30cbf4211; Manufacturer_Part_Number: TLS202A1MBVHTSA1; Mouser Part Number: 726-TLS202A1MBVHTSA1; Mouser Price/Stock: https://www.mouser.co.uk/ProductDetail/Infineon-Technologies/TLS202A1MBVHTSA1?qs=0DP5yvOrqYl%252BugsjRWokhA%3D%3D
IC5 = S25FL064LABMFM013: Integrated Circuit; Manufacturer_Name: Infineon; Datasheet Link: https://www.arrow.com/en/products/s25fl064labmfm013/cypress-semiconductor; Height: 2.16mm; Manufacturer_Part_Number: S25FL064LABMFM013; Mouser Part Number: 727-S25FL064LAMFM013; Mouser Price/Stock: https://www.mouser.co.uk/ProductDetail/Infineon-Technologies/S25FL064LABMFM013?qs=HXFqYaX1Q2wJ3%252BtVnB80Jw%3D%3D; Arrow Part Number: S25FL064LABMFM013; Arrow Price/Stock: https://www.arrow.com/en/products/s25fl064labmfm013/cypress-semiconductor
J2 = CMP-17439-000269-1: as J1 on sheet PowerInput; Packaging: Cut Tape; Contact Shape: Rectangular; Insulation Material: Nylon; Contact Type: Outer Shroud Contact; Contact Finish - Mating: TIN; Fastening Type: Ramp; Termination: Solder; Max Operating Temperature: 85°C; Min Operating Temperature: -25°C; Insulation Color: Natural; Number of Rows: 1; Flammability Rating: UL94 V-0; Contact Material: Bronze; Mount: Surface Mount; Series: GH; Connector Type: Header
R14-R17 = CMP-02407-012085-1: RES 10K OHM 1% 1/16W 0402; Temperature Coefficient: 100ppm/°C; Power Rating: 62.5mW; Resistance: 10kR; Lead Free: Lead Free; Max Operating Temperature: 155°C; RoHS Compliant: Yes; Mount: Surface Mount; Min Operating Temperature: -55°C; Termination: Wraparound; Length: 1mm; Resistor Type: Thick Film; Contact Plating: Tin; Tolerance: 1%; Case/Package: Molded
R18-R22 R24 R25 R27 = CMP-03412-045460-1: RES 33Ω ±5% 0.063W 0402; Resistance: 33R; Voltage Rating: 50V; Power Rating: 62.5mW; Temperature Coefficient: 100ppm/°C; Max Power Dissipation: 63mW; Width: 0.5mm; Max Operating Temperature: 155°C; Termination: SMD/SMT; Size Code: 0402; Lead Free: Lead Free; Series: AC; Case Code (Imperial): 0402; RoHS Compliant: Yes; Packaging: Tape and Reel; Features: Moisture Resistant; Case/Package: 0402; Height: 0.015inch; Length: 0.039inch; Number of Terminations: 2; Case Code (Metric): 1005; Tolerance: 5%; Min Operating Temperature: -55°C; Weight: 2.3E-05oz; Resistor Type: Thick Film
R23 R26 R28 R29 R35 = CMP-2002-08276-2: as R3 on sheet PowerInput; Package Quantity: 10; Termination: SMD/SMT; Width: 0.5mm; Military Standard: Not; Length: 1mm; Contact Plating: Tin; Mount: Surface Mount; Packaging: Tape and Reel; Case Code (Imperial): 0402; Tolerance: 1%; Weight: 2.3E-05oz; Number of Pins: 2; Case/Package: 0402; Case Code (Metric): 1005; Lead Free: Lead Free; Number of Terminations: 2; Max Power Dissipation: 63mW; Depth: 0.5mm; Temperature Coefficient: 100ppm/°C; Max Operating Temperature: 155°C; Height: 0.35mm; Features: Automotive AEC-Q200; Composition: Thick Film; Radiation Hardening: No; Voltage Rating: 50V; Min Operating Temperature: -55°C
R30 = CMP-1011-00598-3: RES Thick Film, 6.04kΩ, 1%, 0.063W, 100ppm/°C, 0402; Voltage Rating: 50V; Max Power Dissipation: 63mW; Resistance: 6.04kR; Number of Terminations: 2; Features: Automotive AEC-Q200; Lead Free: Lead Free; Radiation Hardening: No; Case/Package: 0402; Depth: 0.5mm; Composition: Thick Film; Length: 1mm; Width: 0.02inch; Temperature Coefficient: 100ppm/°C; Min Operating Temperature: -55°C; Voltage Rating (DC): 50V; Contact Plating: Tin; Military Standard: Not; Package Quantity: 10; Case Code (Imperial): 0402; Weight: 2.3E-05oz; Tolerance: 1%; Power Rating: 63mW; Max Operating Temperature: 155°C; Packaging: Tape and Reel; Number of Pins: 2; Height: 0.35mm; Termination: SMD/SMT; Case Code (Metric): 1005
R31-R34 = CMP-2002-00210-1: Manufacturer: Vishay Dale; Part Number: CRCW040275R0FKED
SWD1 = CMP-02766-001448-1: CONN HEADER SMD 14POS 1.27MM; Gender: Male; Connector Type: Male Pin; Number of Contacts: 14; Row Spacing: 0.05inch; Min Operating Temperature: -55°C; Package Quantity: 1; Lead Free: Lead Free; RoHS Compliant: Yes; Contact Material: Bronze; Contact Plating: Gold; Number of Rows: 2; Housing Material: Polymer; Contact Type: Male Pin; Series: FTSH; Max Operating Temperature: 125°C; Orientation: Straight; Number of Positions: 14; Pitch: 1.27mm; Housing Color: Black; Color: Black; Radiation Hardening: No; Length: 8.89mm; Termination: Solder; Packaging: Rail/Tube; Depth: 5.84mm; Mount: Surface Mount; Contact Mating Length: 0.12inch
T1 = HM1188NL: Transformer; Manufacturer_Name: Pulse Electronics; Datasheet Link: https://componentsearchengine.com/Datasheets/1/HM1188NL.pdf; Height: 5.969mm; Manufacturer_Part_Number: HM1188NL; Mouser Part Number: 673-HM1188NL; Mouser Price/Stock: https://www.mouser.co.uk/ProductDetail/Pulse-Electronics/HM1188NL?qs=IbBl3rwNelMAAot5OPq3lA%3D%3D; Arrow Part Number: HM1188NL; Arrow Price/Stock: https://www.arrow.com/en/products/hm1188nl/pulse-electronics-corporation?region=nac
TP5-TP7 = CMP-00028-00002-2: 0.6mm round; Pins: 1
U1 = CMP-0243-00053-2: ARM Cortex-M4 32-bit MCU+FPU, 210 DMIPS, 2048 kB Flash, 256 kB Internal RAM, 114 I/Os, 144-pin LQFP, -40 to 85 degC, Tray; Manufacturer: STMicroelectronics; I/Os (High Current): 114; Operating Frequency(F) (Processor speed) (MHz): 168; Supply Voltage(Vcc) max (V): 3.6; FLASH Size (Prog) (kB): 2048; Internal RAM Size (kB): 256; D/A Converter: 2x12-bit; Supply Voltage(Vcc) min (V): 1.8; PartNumber: STM32F427ZIT6; PackageReference: LQFP144; ComponentLink2Description: Datasheet; PackageVersion: Rev. 4, 06/2013; Core: ARM Cortex-M4; Mounting Technology: Surface Mount; ComponentLink3Description: Package Specification; PackageDescription: 144-Pin Low Profile Quad Flat Package, 20 x 20 mm Body, 0.5 mm Pitch; ComponentLink1Description: Manufacturer URL; ComponentLink2URL: http://www.st.com/st-web-ui/static/active/en/resource/technical/document/datasheet/DM00071990.pdf; ComponentLink3URL: http://www.st.com/st-web-ui/static/active/en/resource/technical/document/datasheet/DM00037051.pdf; Packing: Tray; ComponentLink1URL: http://www.st.com/web/en/home.html; DatasheetVersion: Rev. 1
U2 = CMP-06281-000125-1: IC TRANSCEIVER FULL 1/1 32QFN; Data Rate: 100Mbps; Min Supply Voltage: 1.14V; Simplex/Duplex: Full Duplex; Max Supply Voltage: 3.465V; Packaging: Tray; Mount: Surface Mount; Case/Package: QFN; Max Operating Temperature: 105°C; Number of Pins: 32; Series: -; RoHS Compliant: No; REACH SVHC: No SVHC; Min Operating Temperature: -40°C
X1 = MC2016K25.0000C16ESH: XTAL OSC XO 25.0000MHZ CMOS SMD; Manufacturer_Name: KYOCERA; Geometry.Height: 0.8mm; Mouser Part Number: 581-MC2016K25.C16ESH; Mouser Price/Stock: https://www.mouser.co.uk/ProductDetail/KYOCERA-AVX/MC2016K25.0000C16ESH?qs=yTuLhIm%2Fv1ApwYpapkX4jg%3D%3D; Manufacturer_Part_Number: MC2016K25.0000C16ESH; Datasheet Link: https://media.digikey.com/pdf/Data%20Sheets/AVX%20PDFs/MC2016K25.0000C16ESH_Spec~.pdf
Y1 = MC2520Z8.00000C19XSH: Crystal or Oscillator; Manufacturer_Name: Kyocera AVX; Datasheet Link: https://kr.mouser.com/datasheet/2/909/clock_mcz_xz_e-1845782.pdf; Height: 0.9mm; Manufacturer_Part_Number: MC2520Z8.00000C19XSH; Mouser Part Number: 346-MC2520Z8.00000C1; Mouser Price/Stock: https://www.mouser.co.uk/ProductDetail/Kyocera-Electronic-Components/MC2520Z800000C19XSH?qs=GBLSl2AkiruYmi3bsNLTwA%3D%3D

## Sheet Controllers.SchDoc
size A4; SheetNumber: 4; SheetTotal: 7
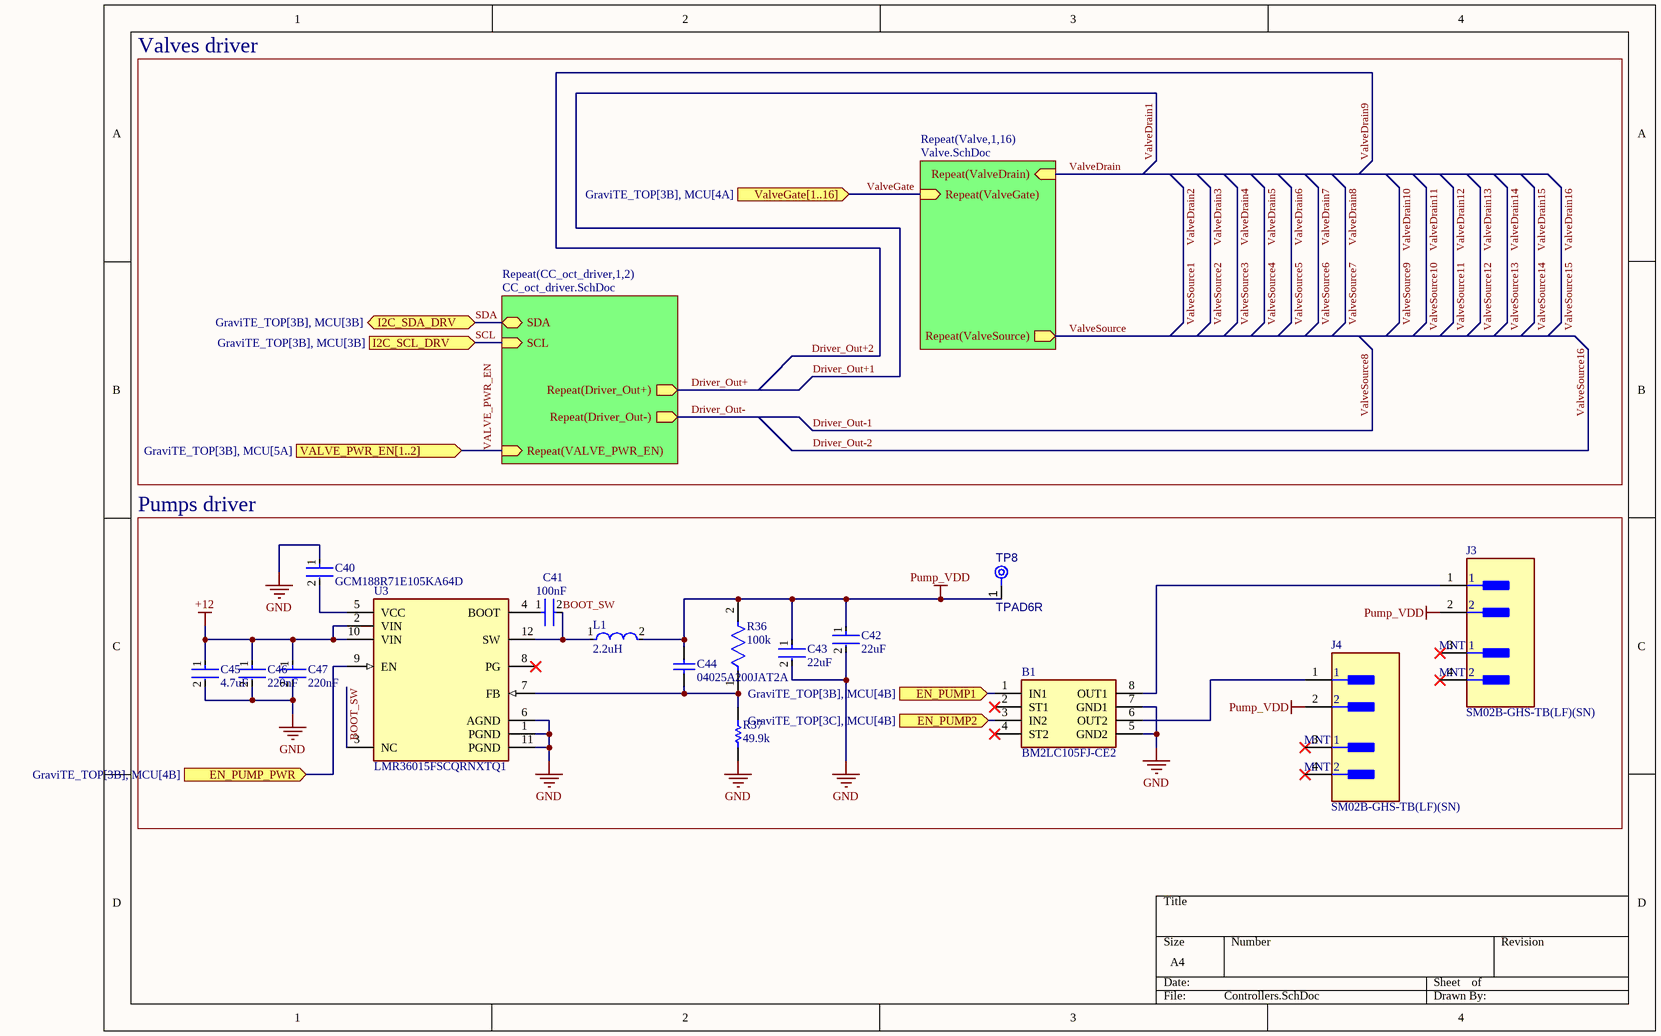
[diagram p3: Controllers.SchDoc]

### Parts
B1  BM2LC105FJ-CE2  [SOIC127P600X165-8N]
C40  GCM188R71E105KA64D  [FP-GCM188-0_1-MFG]
C41  100nF  [FP-GCM155-0_05-IPC_C]
C42  22uF  [FP-CGA5L-0_3-0_1-IPC_A]
C43  22uF  [FP-CGA5L-0_3-0_1-IPC_A]
C44  04025A200JAT2A  [CAPC1005X56X25NL10T15]
C45  4.7uF  [FP-GCM21B-0_2-e0_2_0_7-IPC_B]
C46  220nF  [FP-GCM188-0_1-IPC_B]
C47  220nF  [FP-GCM188-0_1-IPC_B]
J3  SM02B-GHS-TB(LF)(SN)  [FP-SM02B-GHS-TB_LF_SN-MFG]
J4  SM02B-GHS-TB(LF)(SN)  [FP-SM02B-GHS-TB_LF_SN-MFG]
L1  2.2uH  [FP-MLP2520S-MFG]
R36  100k  [FP-RMCF0402-IPC_C]
R37  49.9k  [RESC1005X40X25LL05T05]
TP8  TPAD6R  [TP06R]  (no BOM)
U3  LMR36015FSCQRNXTQ1  [FP-RNX0012B-MFG]

### Blocks framed on the sheet
Pumps driver: B1 C40-C47 J3 J4 L1 R36 R37 TP8 U3

### Sub-sheets
Repeat(CC_oct_driver,1,2) = CC_oct_driver.SchDoc: Repeat(Driver_Out+) (out), Repeat(VALVE_PWR_EN) (in), Repeat(Driver_Out-) (out), SDA (bidir), SCL (in)
Repeat(Valve,1,16) = Valve.SchDoc: Repeat(ValveDrain) (in), Repeat(ValveGate) (in), Repeat(ValveSource) (out)

### Ports
EN_PUMP1 (in, see GraviTE_TOP[3B], MCU[4B]), EN_PUMP2 (in, see GraviTE_TOP[3C], MCU[4B]), EN_PUMP_PWR (in, see GraviTE_TOP[3B], MCU[4B]), I2C_SCL_DRV (in, see GraviTE_TOP[3B], MCU[3B]), I2C_SDA_DRV (bidir, see GraviTE_TOP[3B], MCU[3B]), VALVE_PWR_EN[1..2] (in, see GraviTE_TOP[3B], MCU[5A]), ValveGate[1..16] (in, see GraviTE_TOP[3B], MCU[4A])

### Nets
+12: C45.1 C46.1 C47.1 U3.2(VIN) U3.10(VIN)
GND: B1.5(GND2) B1.7(GND1) C40.1 C42.2 C43.2 C45.2 C46.2 C47.2 R37.1 U3.1(PGND) U3.6(AGND) U3.11(PGND)
Pump_VDD: C42.1 C43.1 C44.2 J3.2 J4.2 L1.2 R36.2 TP8.1(TP)
BOOT_SW: C41.2 L1.1 U3.3(NC) U3.12(SW)
Driver_Out+: sheet Repeat(CC_oct_driver,1,2)/Repeat(Driver_Out+)
Driver_Out-: sheet Repeat(CC_oct_driver,1,2)/Repeat(Driver_Out-)
EN_PUMP1: B1.1(IN1) ; port EN_PUMP1
EN_PUMP2: B1.3(IN2) ; port EN_PUMP2
EN_PUMP_PWR: U3.9(EN) ; port EN_PUMP_PWR
SCL: port I2C_SCL_DRV, sheet Repeat(CC_oct_driver,1,2)/SCL
SDA: port I2C_SDA_DRV, sheet Repeat(CC_oct_driver,1,2)/SDA
VALVE_PWR_EN: sheet Repeat(CC_oct_driver,1,2)/Repeat(VALVE_PWR_EN)
ValveDrain: sheet Repeat(Valve,1,16)/Repeat(ValveDrain)
ValveGate: sheet Repeat(Valve,1,16)/Repeat(ValveGate)
ValveSource: sheet Repeat(Valve,1,16)/Repeat(ValveSource)
NetB1_6: B1.6(OUT2) J4.1
NetB1_8: B1.8(OUT1) J3.1
NetC40_2: C40.2 U3.5(VCC)
NetC41_1: C41.1 U3.4(BOOT)
NetC44_1: C44.1 R36.1 R37.2 U3.7(FB)

Not connected (* = marked no-connect by the designer): B1 2(ST1)* 4(ST2)*; J3 3(MNT_1)* 4(MNT_2)*; J4 3(MNT_1)* 4(MNT_2)*; U3 8(PG)*

### Notes on the sheet
- Valves driver

### Library data of the parts
B1 = BM2LC105FJ-CE2: Smart Low Side Switch ICs; Manufacturer_Name: ROHM Semiconductor; Geometry.Height: 1.65mm; Mouser Part Number: 755-BM2LC105FJ-CE2; Mouser Price/Stock: https://www.mouser.co.uk/ProductDetail/ROHM-Semiconductor/BM2LC105FJ-CE2?qs=YCa%2FAAYMW02vvU7sqt7v8g%3D%3D; Manufacturer_Part_Number: BM2LC105FJ-CE2; Datasheet Link: https://www.mouser.de/datasheet/2/348/bxxlc105fj-c-e-1807787.pdf
C40 = CMP-2006-02363-4: as C1 on sheet PowerInput; Thickness: 889µm; Max Operating Temperature: 125°C; Radiation Hardening: No; Weight: 6.293594mg; Lead Free: Lead Free; Mount: Surface Mount; Case Code (Imperial): 0603; REACH SVHC: No SVHC; Lifecycle Status: Production; Depth: 800µm; Min Operating Temperature: -55°C; Height: 800µm; Case Code (Metric): 1608; Case/Package: 0603; Voltage: 25V; Packaging: Cut Tape; Length: 1.6mm; Termination: SMD/SMT; Width: 787.4µm; Voltage Rating (DC): 25V; RoHS: Compliant; Schedule B: 8532240020, 8532240020; Ratings: AEC-Q200
C41 = CMP-2008-03711-3: as C7 on sheet MCU; Termination: SMD/SMT; Length: 1mm; Voltage: 16V; Mount: Surface Mount; Packaging: Tape and Reel; Case Code (Metric): 1005; Case/Package: 0402; Voltage Rating: 16V; Min Operating Temperature: -55°C; Case Code (Imperial): 0402; Ratings: AEC-Q200; Height: 0.5mm; Tolerance: 10%; Width: 0.02inch; Radiation Hardening: No; Depth: 0.5mm; Capacitance: 100nF; Max Operating Temperature: 125°C; Package Quantity: 1; REACH SVHC: No SVHC; Thickness: 0.022inch; Dielectric: X7R; Lead Free: Lead Free
C42 C43 = CMP-08246-001863-1: Cap Ceramic 22uF 16V X5R 20% Pad SMD 1206 +85°C Automotive T/R; Height: 1.6mm; Weight: 0.000571oz; Lead Free: Lead Free; Min Operating Temperature: -55°C; Max Operating Temperature: 85°C; Case Code (Metric): 3216; Capacitance: 22uF; Case Code (Imperial): 1206; Voltage Rating: 16V; Packaging: Tape and Reel; Voltage Rating (DC): 16V; Ratings: AEC-Q200; Length: 0.126inch; Case/Package: 1206; Width: 0.063inch; Package Quantity: 2000; Dielectric: X5R; Thickness: 0.071inch; Mount: Surface Mount; Tolerance: 20%; Termination: SMD/SMT
C44 = CMP-2008-02607-1: Manufacturer: AVX Interconnect / Elco; Part Number: 04025A200JAT2A
C45 = CMP-06035-045423-1: Ceramic Capacitor for Automotive 4.7uF ±10% 25VDC X7S 0805 Embossed T/R
C46 C47 = CMP-2006-02366-2: Ceramic Capacitor for Automotive 220nF  ±10% 25VDC X7R 0603 Paper T/R; Voltage: 25V; Capacitance: 220nF; Mount: Surface Mount; Ratings: AEC-Q200; Case/Package: 0603; Packaging: Tape and Reel; Radiation Hardening: No; Dielectric: X7R; Case Code (Imperial): 0603; Max Operating Temperature: 125°C; Min Operating Temperature: -55°C; Depth: 0.8mm; Termination: SMD/SMT; Package Quantity: 1; Case Code (Metric): 1608; Thickness: 0.035inch; Voltage Rating: 25V; Tolerance: 10%; Voltage Rating (DC): 25V; Height: 0.8mm; Lead Free: Lead Free; Length: 1.6mm; Width: 0.031inch
J3 J4 = CMP-2000-07076-2: CONN HEADER SMD R/A 2POS 1.25MM; Voltage Rating: 50V; Number of Positions: 2; Pitch: 0.049inch; Current Rating: 1A; Connector Type: Outer Shroud Contact; Number of Rows: 1; Contact Material: Bronze; Termination: Solder; Color: Natural; Package Quantity: 2500; Mount: Surface Mount; Housing Color: Natural; Number of Contacts: 2; Packaging: Tape and Reel; Lead Free: Lead Free; Housing Material: Nylon; Orientation: Right Angle; Contact Type: Male Pin; Contact Plating: Tin; Series: GH; Fastening Type: Latch
L1 = CMP-08253-000030-1: Shielded Multilayer Inductor 2.2uH ±20% 1200mA 143mΩ SMD 1008; Test Frequency: 2MHz; Current Rating: 1.2A; DC Resistance (DCR): 143mR; Inductance: 2.5uH; Core Material: Ferrite; Packaging: Tape and Reel; Height - Seated (Max): 0.039inch; Tolerance: 20%; Case Code (Imperial): 1008; Case Code (Metric): 2520; Max Operating Temperature: 125°C; Shielding: Shielded; Package Quantity: 3000; Min Operating Temperature: -40°C; Mount: Surface Mount; RoHS Compliant: Yes; Width: 0.079inch; Case/Package: 1008; Length: 0.098inch
R36 = CMP-2000-06984-2: 100kΩ ±1% 0.063W 0402 Thick Film Chip Resistor AEC-Q200 compliant; Max Power Dissipation: 63mW; Resistance: 100kR; Temperature Coefficient: 100ppm/°C; Power Rating: 62.5mW; Packaging: Tape and Reel; Size Code: 0402; Resistor Type: Thick Film; Features: Automotive AEC-Q200; Case Code (Metric): 1005; RoHS Compliant: Yes; Length: 1mm; Radiation Hardening: No; Military Standard: Not; Case Code (Imperial): 0402; Depth: 0.5mm; Max Operating Temperature: 155°C; Lead Free: Lead Free; Case/Package: 0402; Tolerance: 1%; Construction: Rectangular; Number of Terminations: 2; Mount: Surface Mount; Min Operating Temperature: -55°C; Width: 0.02inch; Series: RMCF; Contact Plating: Tin; Height: 0.016inch
R37 = CMP-2002-00967-3: Chip Resistor, 49.9 KOhm, +/- 1%, 100 mW, -55 to 155 degC, 0402 (1005 Metric), RoHS, Tape and Reel; Manufacturer: Basic Passives; PartNumber: ERJ-2RKF4992X; Case\/Package: 0402; Power Rating: 100 mW; Voltage Rating: 50 V; Pins: 2; Case Code (Imperial): 0402; Package Quantity: 10000; REACH SVHC: No SVHC; DatasheetVersion: 04/2015; Width: 0.5 mm; Height: 0.35 mm; Case Code (Metric): 1005; ComponentLink2URL: http://industrial.panasonic.com/cdbs/www-data/pdf/RDA0000/AOA0000C86.pdf; Mounting Technology: Surface Mount; ComponentLink1Description: Manufacturer URL; Resistance: 49.9 KOhm; PackageDescription: 2-Pin Surface Mount Device, Body 1 x 0.5 mm; Radiation Hardening: No; RoHSCompliant: true; PackageReference: 0402; Max Operating Temperature: 155 degC; Packaging: Tape and Reel; Mount: Surface Mount; Tolerance: 1%; Min Operating Temperature: -55 degC; ComponentLink1URL: http://www.panasonic.com/; ComponentLink2Description: Datasheet; Length: 1 mm
TP8 = CMP-00028-00002-2: 0.6mm round; Pins: 1
U3 = CMP-04918-000451-1: IC REG BUCK ADJ 1.5A 12VQFN; RoHS Compliant: Yes

## Sheet CC_oct_driver.SchDoc
size A4; SheetNumber: 5; SheetTotal: 7
Used 2 times, as channels Designator/CC_oct_driver1, Designator/CC_oct_driver2. Parts and nets are listed once, with the designators drawn on the sheet.
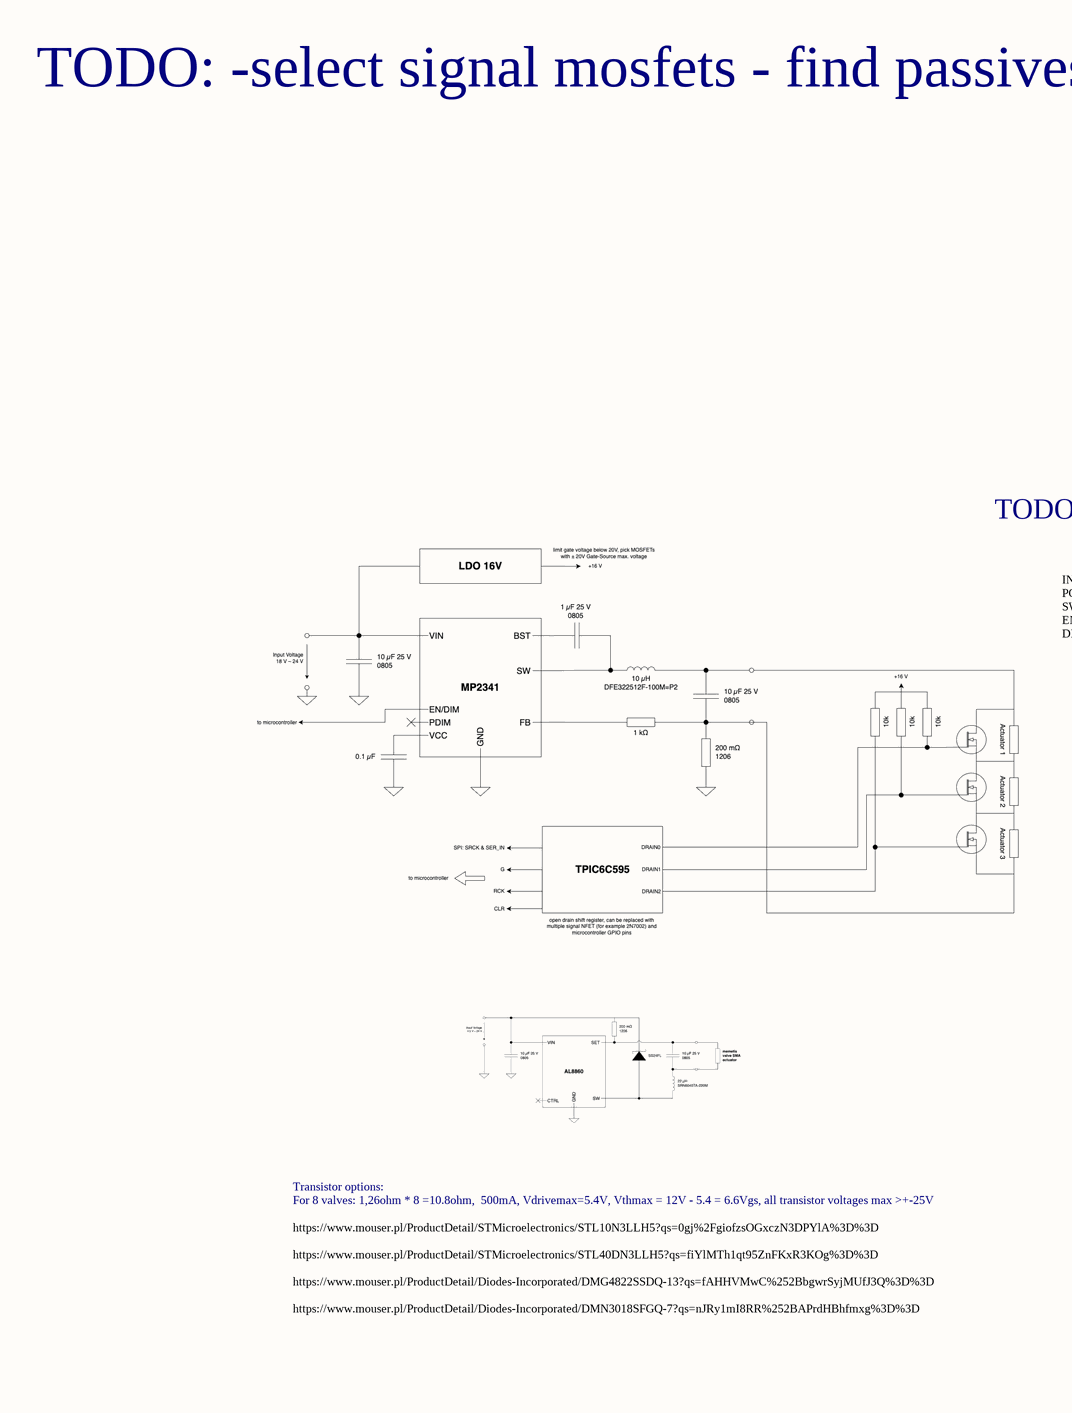
[diagram p4: CC_oct_driver.SchDoc, left]
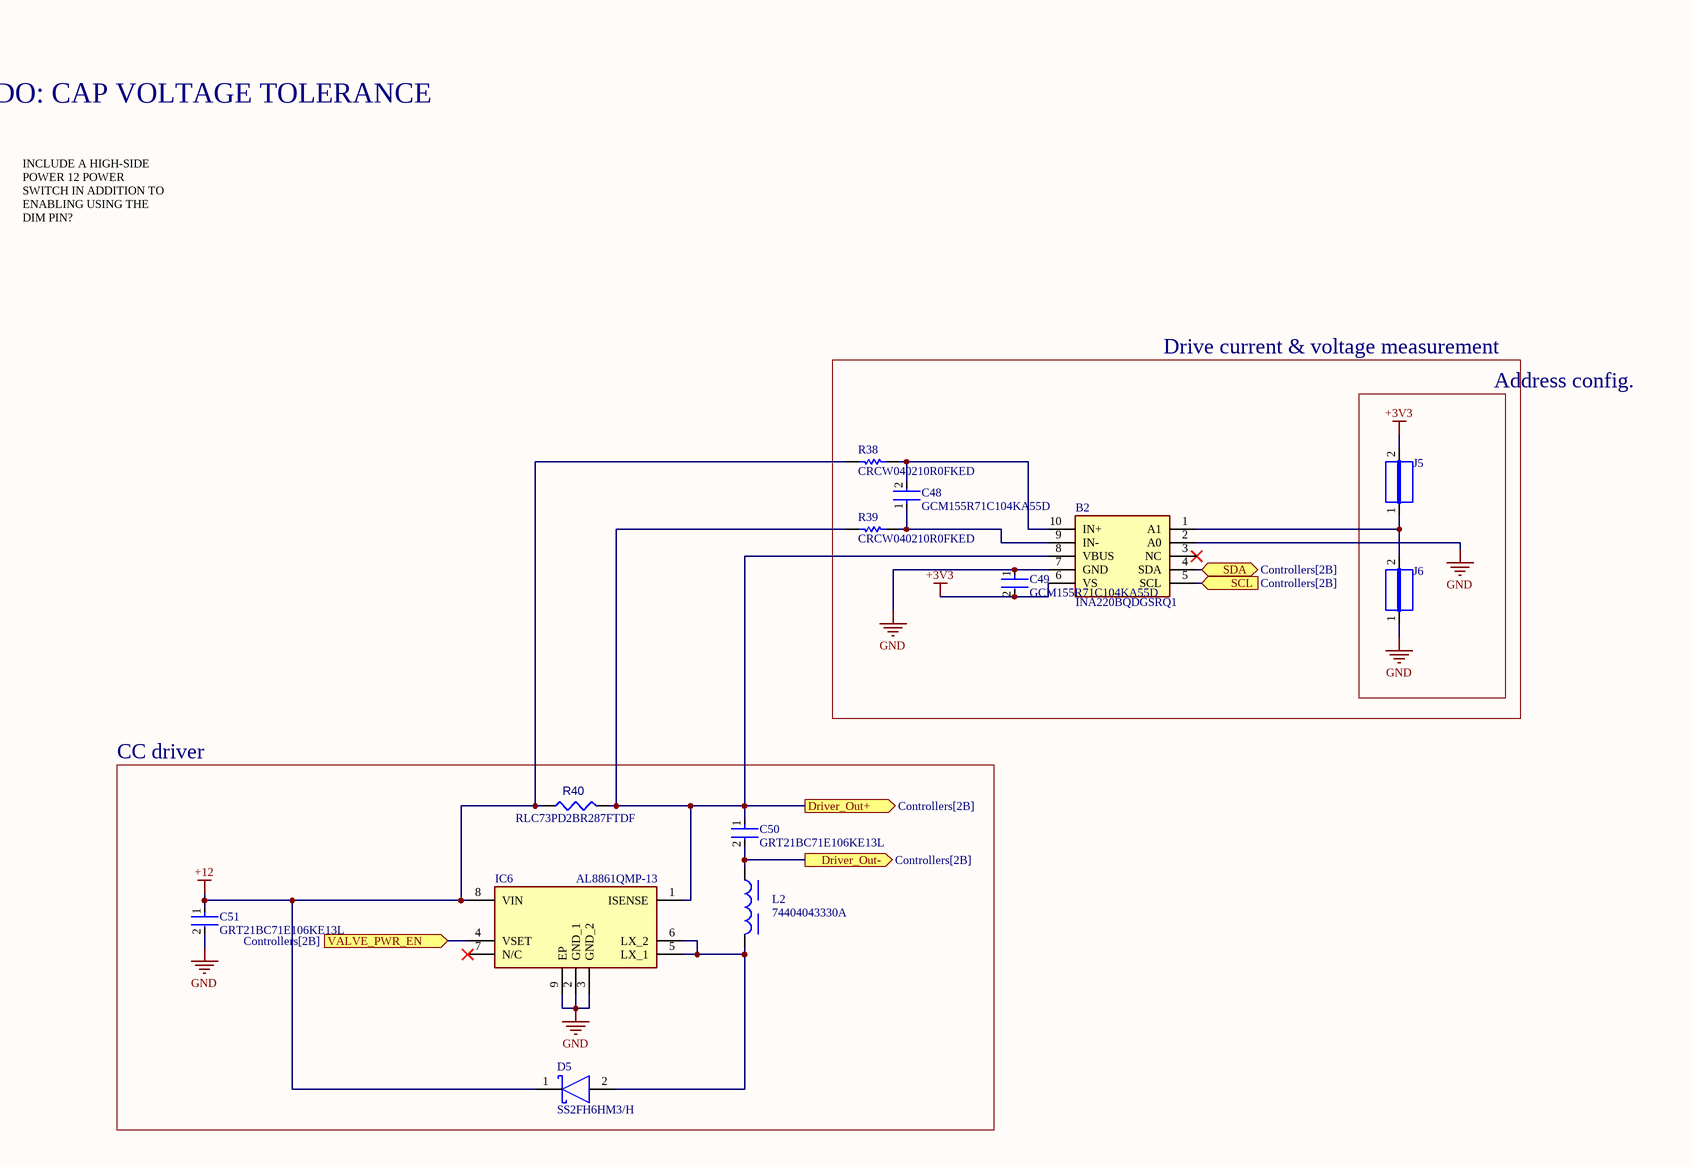
[diagram p5: CC_oct_driver.SchDoc, right]

### Parts
B2  INA220BQDGSRQ1  [SOP50P490X110-10N]
C48  GCM155R71C104KA55D  [FP-GCM155-0_05-IPC_C]
C49  GCM155R71C104KA55D  [FP-GCM155-0_05-IPC_C]
C50  GRT21BC71E106KE13L  [FP-GRT21B-0_2-IPC_B]
C51  GRT21BC71E106KE13L  [FP-GRT21B-0_2-IPC_B]
D5  SS2FH6HM3/H  [FP-S8-V-3915_01-001-MFG]
IC6  AL8861QMP-13  [SOP65P490X110-9N]
J5  JUMPER  [JUMPER]  (value not drawn)
J6  JUMPER  [JUMPER]  (value not drawn)
L2  74404043330A  [WE-LQS_4025]
R38  CRCW040210R0FKED  [RESC1005X40X25NL05T05]
R39  CRCW040210R0FKED  [RESC1005X40X25NL05T05]
R40  RLC73PD2BR287FTDF  [R1206]

### Blocks framed on the sheet
Drive current & voltage measurement: B2 C48 C49 R38 R39
Address config.: J5 J6
CC driver: C50 C51 D5 IC6 L2 R40

### Ports
Driver_Out+ (out, see Controllers[2B]), Driver_Out- (out, see Controllers[2B]), SCL (in, see Controllers[2B]), SDA (bidir, see Controllers[2B]), VALVE_PWR_EN (in, see Controllers[2B])

### Nets
+3V3: B2.6(VS) C49.2 J5.2
+12: C51.1 D5.1(C) IC6.8(VIN) R38.1 R40.1
GND: B2.2(A0) B2.7(GND) C49.1 C51.2 IC6.2(GND_1) IC6.3(GND_2) IC6.9(EP) J6.1
Driver_Out+: B2.8(VBUS) C50.1 IC6.1(ISENSE) R39.1 R40.2 ; port Driver_Out+
Driver_Out-: C50.2 L2.1 ; port Driver_Out-
SCL: B2.5(SCL) ; port SCL
SDA: B2.4(SDA) ; port SDA
VALVE_PWR_EN: IC6.4(VSET) ; port VALVE_PWR_EN
NetB2_1: B2.1(A1) J5.1 J6.2
NetB2_9: B2.9(IN-) C48.1 R39.2
NetB2_10: B2.10(IN+) C48.2 R38.2
NetD5_2: D5.2(A) IC6.5(LX_1) IC6.6(LX_2) L2.2

Not connected (* = marked no-connect by the designer): B2 3(NC)*; IC6 7(N/C)*

### Channels
Designator/CC_oct_driver1: designators end in _CC_oct_driver1; ports Driver_Out+=Driver_Out+1 Driver_Out-=Driver_Out-1 SCL=SCL SDA=SDA VALVE_PWR_EN=VALVE_PWR_EN1
Designator/CC_oct_driver2: designators end in _CC_oct_driver2; ports Driver_Out+=Driver_Out+2 Driver_Out-=Driver_Out-2 SCL=SCL SDA=SDA VALVE_PWR_EN=VALVE_PWR_EN2

### Notes on the sheet
- TODO: -select signal mosfets - find passives(or replace them with gate drivers), CALCULATE THE SWITCHING FREQUENCY AND INDUCTANCE
- TODO: CAP VOLTAGE TOLERANCE
- INCLUDE A HIGH-SIDE POWER 12 POWER SWITCH IN ADDITION TO ENABLING USING THE DIM PIN?
- For 8 valves: 1,26ohm * 8 =10.8ohm,  500mA, Vdrivemax=5.4V, Vthmax = 12V - 5.4 = 6.6Vgs, all transistor voltages max >+-25V
- Transistor options:
- https://www.mouser.pl/ProductDetail/STMicroelectronics/STL10N3LLH5?qs=0gj%2FgiofzsOGxczN3DPYlA%3D%3D
- https://www.mouser.pl/ProductDetail/STMicroelectronics/STL40DN3LLH5?qs=fiYlMTh1qt95ZnFKxR3KOg%3D%3D
- https://www.mouser.pl/ProductDetail/Diodes-Incorporated/DMG4822SSDQ-13?qs=fAHHVMwC%252BbgwrSyjMUfJ3Q%3D%3D
- https://www.mouser.pl/ProductDetail/Diodes-Incorporated/DMN3018SFGQ-7?qs=nJRy1mI8RR%252BAPrdHBhfmxg%3D%3D

### Library data of the parts
B2 = INA220BQDGSRQ1: Automotive, 26-V, Bi-Directional, Zero-Drift, Low-/High-Side, I2C Out Current/Power Monitor; Manufacturer_Name: Texas Instruments; Geometry.Height: 1.1mm; Mouser Part Number: 595-INA220BQDGSRQ1; Mouser Price/Stock: https://www.mouser.co.uk/ProductDetail/Texas-Instruments/INA220BQDGSRQ1?qs=4whTb%2F0XQMgSmfUlXJGxRQ%3D%3D; Manufacturer_Part_Number: INA220BQDGSRQ1; Datasheet Link: http://www.ti.com/lit/gpn/ina220-q1
C48 C49 = CMP-2008-03711-3: as C7 on sheet MCU; Termination: SMD/SMT; Length: 1mm; Voltage: 16V; Mount: Surface Mount; Packaging: Tape and Reel; Case Code (Metric): 1005; Case/Package: 0402; Voltage Rating: 16V; Min Operating Temperature: -55°C; Case Code (Imperial): 0402; Ratings: AEC-Q200; Height: 0.5mm; Tolerance: 10%; Width: 0.02inch; Radiation Hardening: No; Depth: 0.5mm; Capacitance: 100nF; Max Operating Temperature: 125°C; Package Quantity: 1; REACH SVHC: No SVHC; Thickness: 0.022inch; Dielectric: X7R; Lead Free: Lead Free
C50 C51 = CMP-06035-008164-1: Multi-Layer Ceramic Capacitor 10uF 25V X7S ±10% 0805 Emboss T/R
D5 = CMP-00030-65895446-1: SS2FH6HM3/H Diode Schottky 60V 2A Automotive 2-Pin SMF T/R; Max Reverse Voltage (DC): 60V; Mount: Surface Mount; NexarPartId: 65895446; Average Rectified Current: 2A; RoHS: Compliant; Packaging: Cut Tape (CT); Schedule B: 8541100080, 8541100080
IC6 = AL8861QMP-13: LED Lighting Drivers LED MV Int Switch MSOP-8EP T&R 2.5K; Manufacturer_Name: Diodes Incorporated; Geometry.Height: 1.1mm; Datasheet Link: https://componentsearchengine.com/Datasheets/1/AL8861QMP-13.pdf; Manufacturer_Part_Number: AL8861QMP-13; Mouser Part Number: 621-AL8861QMP-13; Mouser Price/Stock: https://www.mouser.co.uk/ProductDetail/Diodes-Incorporated/AL8861QMP-13?qs=T3oQrply3y9Ug0fmv4aCFA%3D%3D
J5 J6 = CMP-009-00061-2: Pins: 2
L2 = CMP-03913-77814862-1: 74404043330A WE-LQS SMT Semi-Shielded Power Inductor; Current Rating: 880mA; Inductance Tolerance: 20%; Inductance: 33µH; DC Resistance (DCR): 316mΩ; Ambient Temperature Range High: 85°C; Min Operating Temperature: -40°C; Length: 4mm; Height: 2.5mm; RoHS: Compliant; Ambient Temperature Range Low: -40°C; Width: 4mm; Max Operating Temperature: 125°C; NexarPartId: 77814862
R38 R39 = CMP-2002-08143-1: Manufacturer: Vishay Dale; Part Number: CRCW040210R0FKED
R40 = Resistor: Value: RLC73PD2BR287FTDF